# Altium project VNA_BASE_AF2P.PrjPcb
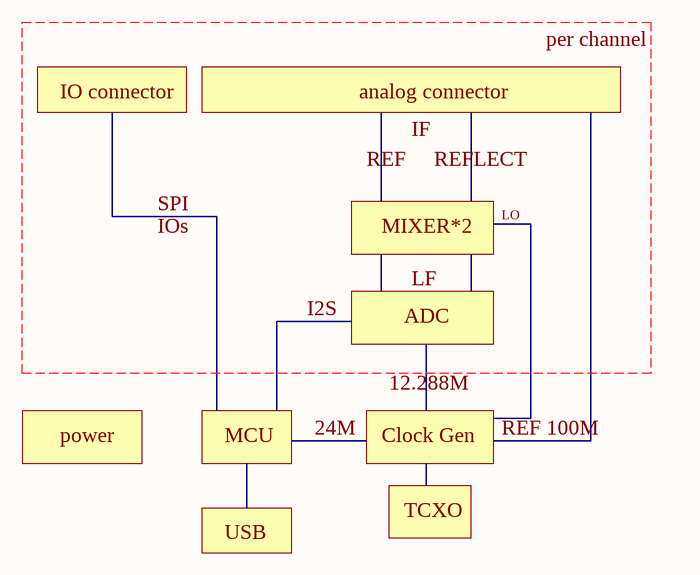
[diagram p0: block_diagram.SchDoc]
10 sheets, 383 parts. Net scope: flat (ports and power ports of the same name join across sheets).
Board file: VNA_BASE_AF2P.PcbDoc
Sheets:
  block_diagram.SchDoc
  downmixersA.SchDoc
  downmixersB.SchDoc
  AudioADCA.SchDoc
  AudioADCB.SchDoc
  clock.SchDoc
  MCU.SchDoc
  connectorA.SchDoc
  connectorB.SchDoc
  power.SchDoc

## Sheet block_diagram.SchDoc
size A4

### Notes on the sheet
- per channel
- IO connector
- analog connector
- REF
- IF
- REFLECT
- SPI
- IOs
- MIXER*2
- I2S
- ADC
- LF
- 12.288M
- power
- MCU
- 24M
- Clock Gen
- REF 100M
- USB
- TCXO

## Sheet downmixersA.SchDoc
size A4
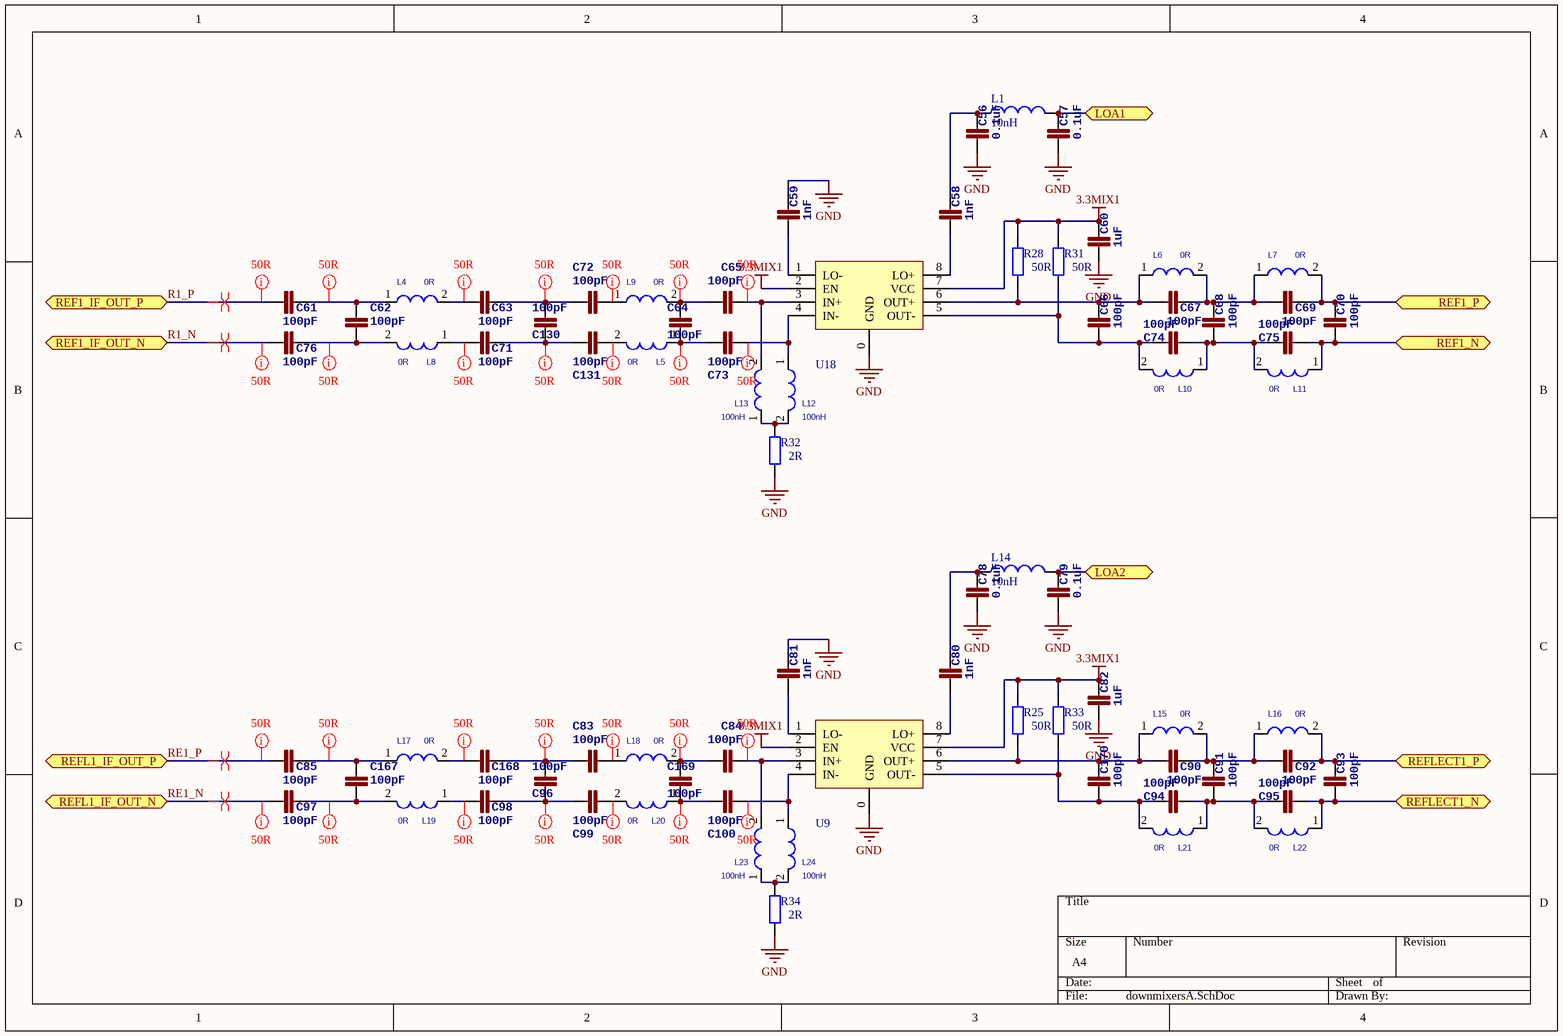
[diagram p1: downmixersA.SchDoc]

### Parts
C56  0.1uF  [0402]
C57  0.1uF  [0402]
C58  1nF  [0402]
C59  1nF  [0402]
C60  1uF  [0402]
C61  100pF  [0402]
C62  100pF  [0402]
C63  100pF  [0402]
C64  100pF  [0402]
C65  100pF  [0402]
C66  100pF  [0402]
C67  100pF  [0402]
C68  100pF  [0402]
C69  100pF  [0402]
C70  100pF  [0402]
C71  100pF  [0402]
C72  100pF  [0402]
C73  100pF  [0402]
C74  100pF  [0402]
C75  100pF  [0402]
C76  100pF  [0402]
C78  0.1uF  [0402]
C79  0.1uF  [0402]
C80  1nF  [0402]
C81  1nF  [0402]
C82  1uF  [0402]
C83  100pF  [0402]
C84  100pF  [0402]
C85  100pF  [0402]
C90  100pF  [0402]
C91  100pF  [0402]
C92  100pF  [0402]
C93  100pF  [0402]
C94  100pF  [0402]
C95  100pF  [0402]
C96  100pF  [0402]
C97  100pF  [0402]
C98  100pF  [0402]
C99  100pF  [0402]
C100  100pF  [0402]
C130  100pF  [0402]
C131  100pF  [0402]
C167  100pF  [0402]
C168  100pF  [0402]
C169  100pF  [0402]
C170  100pF  [0402]
L1  value 10nH  [0402]  (hidden comment: Inductor)
L4  0R  [0805]
L5  0R  [0805]
L6  0R  [0805]
L7  0R  [0805]
L8  0R  [0805]
L9  0R  [0805]
L10  0R  [0805]
L11  0R  [0805]
L12  100nH  [0402]
L13  100nH  [0402]
L14  value 10nH  [0402]  (hidden comment: Inductor)
L15  0R  [0805]
L16  0R  [0805]
L17  0R  [0805]
L18  0R  [0805]
L19  0R  [0805]
L20  0R  [0805]
L21  0R  [0805]
L22  0R  [0805]
L23  100nH  [0402]
L24  100nH  [0402]
R25  50R  [0402]
R28  50R  [0402]
R31  50R  [0402]
R32  2R  [0402]
R33  50R  [0402]
R34  2R  [0402]
U9  LT5560  [LT5560]  (value not drawn)
U18  LT5560  [LT5560]  (value not drawn)

### Ports
LOA1, LOA2, REF1_IF_OUT_N, REF1_IF_OUT_P, REF1_N, REF1_P, REFL1_IF_OUT_N, REFL1_IF_OUT_P, REFLECT1_N, REFLECT1_P

### Nets
3.3MIX1: C60.2 C82.2 R25.2 R28.2 R31.2 R33.2 U9.2(EN) U9.7(VCC) U18.2(EN) U18.7(VCC)
GND: C56.1 C57.1 C59.2 C60.1 C78.1 C79.1 C81.2 C82.1 R32.1 R34.1 U9.0(GND) U18.0(GND)
R1_N: C76.1 ; port REF1_IF_OUT_N
R1_P: C61.1 ; port REF1_IF_OUT_P
RE1_N: C97.1 ; port REFL1_IF_OUT_N
RE1_P: C85.1 ; port REFL1_IF_OUT_P
REF1_N: C70.1 C75.1 L11.1 ; port REF1_N
REF1_P: C69.2 C70.2 L7.2 ; port REF1_P
REFLECT1_N: C93.1 C95.1 L22.1 ; port REFLECT1_N
REFLECT1_P: C92.2 C93.2 L16.2 ; port REFLECT1_P
NetC56_2: C56.2 C58.2 L1.1
NetC57_2: C57.2 L1.2 ; port LOA1
NetC58_1: C58.1 U18.8(LO+)
NetC59_1: C59.1 U18.1(LO-)
NetC61_2: C61.2 C62.2 L4.1
NetC62_1: C62.1 C76.2 L8.2
NetC63_1: C63.1 L4.2
NetC63_2: C63.2 C72.1 C130.1
NetC64_1: C64.1 C73.2 L5.1
NetC64_2: C64.2 C65.1 L9.2
NetC65_2: C65.2 L13.2 U18.3(IN+)
NetC66_1: C66.1 C74.2 L10.2 R31.1 U18.5(OUT-)
NetC66_2: C66.2 C67.1 L6.1 R28.1 U18.6(OUT+)
NetC67_2: C67.2 C68.2 C69.1 L6.2 L7.1
NetC68_1: C68.1 C74.1 C75.2 L10.1 L11.2
NetC71_1: C71.1 L8.1
NetC71_2: C71.2 C130.2 C131.2
NetC72_2: C72.2 L9.1
NetC73_1: C73.1 L12.1 U18.4(IN-)
NetC78_2: C78.2 C80.2 L14.1
NetC79_2: C79.2 L14.2 ; port LOA2
NetC80_1: C80.1 U9.8(LO+)
NetC81_1: C81.1 U9.1(LO-)
NetC83_1: C83.1 C96.1 C168.2
NetC83_2: C83.2 L18.1
NetC84_1: C84.1 C169.2 L18.2
NetC84_2: C84.2 L23.2 U9.3(IN+)
NetC85_2: C85.2 C167.2 L17.1
NetC90_1: C90.1 C170.2 L15.1 R25.1 U9.6(OUT+)
NetC90_2: C90.2 C91.2 C92.1 L15.2 L16.1
NetC91_1: C91.1 C94.1 C95.2 L21.1 L22.2
NetC94_2: C94.2 C170.1 L21.2 R33.1 U9.5(OUT-)
NetC96_2: C96.2 C98.2 C99.2
NetC97_2: C97.2 C167.1 L19.2
NetC98_1: C98.1 L19.1
NetC99_1: C99.1 L20.2
NetC100_1: C100.1 L24.1 U9.4(IN-)
NetC100_2: C100.2 C169.1 L20.1
NetC131_1: C131.1 L5.2
NetC168_1: C168.1 L17.2
NetL12_2: L12.2 L13.1 R32.2
NetL23_1: L23.1 L24.2 R34.2

### Layout directives
net class 50R: NetC61_2, NetC62_1, NetC63_1, NetC63_2, NetC64_1, NetC64_2, NetC65_2, NetC71_1, NetC71_2, NetC72_2, NetC73_1, NetC83_1, NetC83_2, NetC84_1, NetC84_2, NetC85_2, NetC96_2, NetC97_2, NetC98_1, NetC99_1, NetC100_1, NetC100_2, NetC131_1, NetC168_1, R1_N, R1_P, RE1_N, RE1_P
differential pair: R1_N, R1_P, RE1_N, RE1_P

### Library data of the parts
C56-C76 C78-C85 C90-C100 C130 C131 C167-C170 = CAP0402-CAP: <b>Capacitor</b> / Standard 0603 ceramic capacitor, and 0.1" leaded capacitor.; PARTNO: CC0402ZRY5V7BB104
L1 L14 = Inductor: Code_IEC: 1005; Published: 8-Jun-2000; LatestRevisionDate: 29-May-2009; LatestRevisionNote: IPC-7351 Footprint Added.; PackageReference: 0402-A; Publisher: Altium Limited; PackageDescription: Chip Inductor; Code_JEITA: 0402
L4-L13 L15-L24 = L/2.5*2.0
R25 R28 R31-R34 = Res2: Resistor

## Sheet downmixersB.SchDoc
size A4
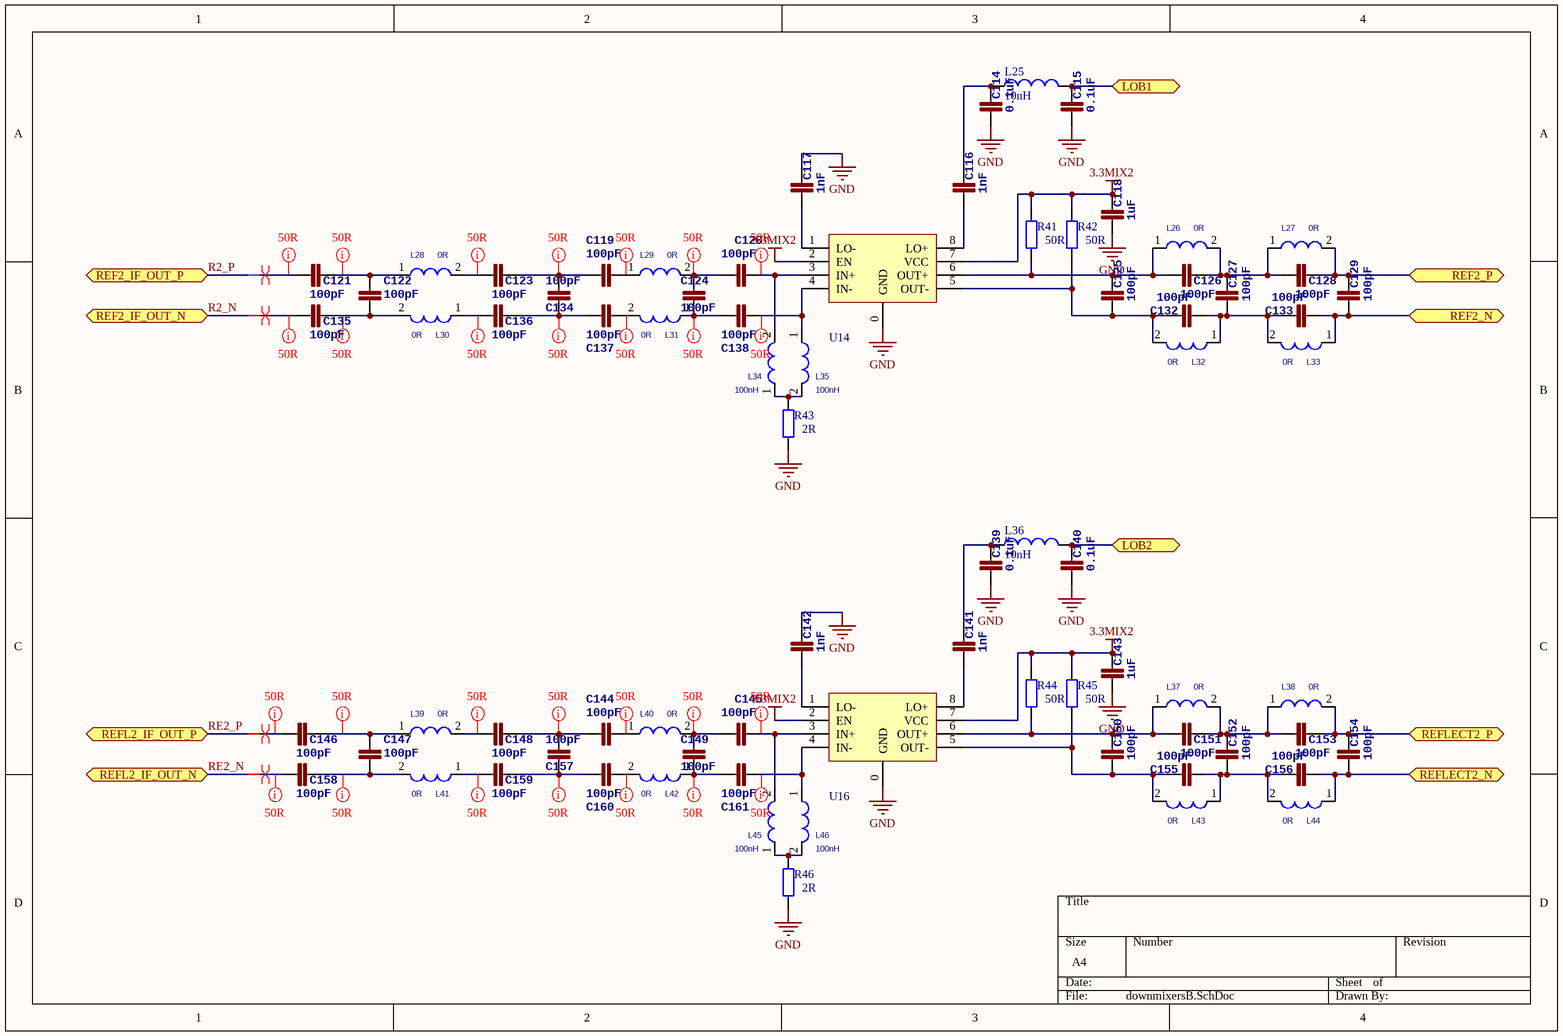
[diagram p2: downmixersB.SchDoc]

### Parts
C114  0.1uF  [0402]
C115  0.1uF  [0402]
C116  1nF  [0402]
C117  1nF  [0402]
C118  1uF  [0402]
C119  100pF  [0402]
C120  100pF  [0402]
C121  100pF  [0402]
C122  100pF  [0402]
C123  100pF  [0402]
C124  100pF  [0402]
C125  100pF  [0402]
C126  100pF  [0402]
C127  100pF  [0402]
C128  100pF  [0402]
C129  100pF  [0402]
C132  100pF  [0402]
C133  100pF  [0402]
C134  100pF  [0402]
C135  100pF  [0402]
C136  100pF  [0402]
C137  100pF  [0402]
C138  100pF  [0402]
C139  0.1uF  [0402]
C140  0.1uF  [0402]
C141  1nF  [0402]
C142  1nF  [0402]
C143  1uF  [0402]
C144  100pF  [0402]
C145  100pF  [0402]
C146  100pF  [0402]
C147  100pF  [0402]
C148  100pF  [0402]
C149  100pF  [0402]
C150  100pF  [0402]
C151  100pF  [0402]
C152  100pF  [0402]
C153  100pF  [0402]
C154  100pF  [0402]
C155  100pF  [0402]
C156  100pF  [0402]
C157  100pF  [0402]
C158  100pF  [0402]
C159  100pF  [0402]
C160  100pF  [0402]
C161  100pF  [0402]
L25  value 10nH  [0402]  (hidden comment: Inductor)
L26  0R  [0805]
L27  0R  [0805]
L28  0R  [0805]
L29  0R  [0805]
L30  0R  [0805]
L31  0R  [0805]
L32  0R  [0805]
L33  0R  [0805]
L34  100nH  [0402]
L35  100nH  [0402]
L36  value 10nH  [0402]  (hidden comment: Inductor)
L37  0R  [0805]
L38  0R  [0805]
L39  0R  [0805]
L40  0R  [0805]
L41  0R  [0805]
L42  0R  [0805]
L43  0R  [0805]
L44  0R  [0805]
L45  100nH  [0402]
L46  100nH  [0402]
R41  50R  [0402]
R42  50R  [0402]
R43  2R  [0402]
R44  50R  [0402]
R45  50R  [0402]
R46  2R  [0402]
U14  LT5560  [LT5560]  (value not drawn)
U16  LT5560  [LT5560]  (value not drawn)

### Ports
LOB1, LOB2, REF2_IF_OUT_N, REF2_IF_OUT_P, REF2_N, REF2_P, REFL2_IF_OUT_N, REFL2_IF_OUT_P, REFLECT2_N, REFLECT2_P

### Nets
3.3MIX2: C118.2 C143.2 R41.2 R42.2 R44.2 R45.2 U14.2(EN) U14.7(VCC) U16.2(EN) U16.7(VCC)
GND: C114.1 C115.1 C117.2 C118.1 C139.1 C140.1 C142.2 C143.1 R43.1 R46.1 U14.0(GND) U16.0(GND)
R2_N: C135.1 ; port REF2_IF_OUT_N
R2_P: C121.1 ; port REF2_IF_OUT_P
RE2_N: C158.1 ; port REFL2_IF_OUT_N
RE2_P: C146.1 ; port REFL2_IF_OUT_P
REF2_N: C129.1 C133.1 L33.1 ; port REF2_N
REF2_P: C128.2 C129.2 L27.2 ; port REF2_P
REFLECT2_N: C154.1 C156.1 L44.1 ; port REFLECT2_N
REFLECT2_P: C153.2 C154.2 L38.2 ; port REFLECT2_P
NetC114_2: C114.2 C116.2 L25.1
NetC115_2: C115.2 L25.2 ; port LOB1
NetC116_1: C116.1 U14.8(LO+)
NetC117_1: C117.1 U14.1(LO-)
NetC119_1: C119.1 C123.2 C134.1
NetC119_2: C119.2 L29.1
NetC120_1: C120.1 C124.2 L29.2
NetC120_2: C120.2 L34.2 U14.3(IN+)
NetC121_2: C121.2 C122.2 L28.1
NetC122_1: C122.1 C135.2 L30.2
NetC123_1: C123.1 L28.2
NetC124_1: C124.1 C138.2 L31.1
NetC125_1: C125.1 C132.2 L32.2 R42.1 U14.5(OUT-)
NetC125_2: C125.2 C126.1 L26.1 R41.1 U14.6(OUT+)
NetC126_2: C126.2 C127.2 C128.1 L26.2 L27.1
NetC127_1: C127.1 C132.1 C133.2 L32.1 L33.2
NetC134_2: C134.2 C136.2 C137.2
NetC136_1: C136.1 L30.1
NetC137_1: C137.1 L31.2
NetC138_1: C138.1 L35.1 U14.4(IN-)
NetC139_2: C139.2 C141.2 L36.1
NetC140_2: C140.2 L36.2 ; port LOB2
NetC141_1: C141.1 U16.8(LO+)
NetC142_1: C142.1 U16.1(LO-)
NetC144_1: C144.1 C148.2 C157.1
NetC144_2: C144.2 L40.1
NetC145_1: C145.1 C149.2 L40.2
NetC145_2: C145.2 L45.2 U16.3(IN+)
NetC146_2: C146.2 C147.2 L39.1
NetC147_1: C147.1 C158.2 L41.2
NetC148_1: C148.1 L39.2
NetC149_1: C149.1 C161.2 L42.1
NetC150_1: C150.1 C155.2 L43.2 R45.1 U16.5(OUT-)
NetC150_2: C150.2 C151.1 L37.1 R44.1 U16.6(OUT+)
NetC151_2: C151.2 C152.2 C153.1 L37.2 L38.1
NetC152_1: C152.1 C155.1 C156.2 L43.1 L44.2
NetC157_2: C157.2 C159.2 C160.2
NetC159_1: C159.1 L41.1
NetC160_1: C160.1 L42.2
NetC161_1: C161.1 L46.1 U16.4(IN-)
NetL34_1: L34.1 L35.2 R43.2
NetL45_1: L45.1 L46.2 R46.2

### Layout directives
net class 50R: NetC119_1, NetC119_2, NetC120_1, NetC120_2, NetC121_2, NetC122_1, NetC123_1, NetC124_1, NetC134_2, NetC136_1, NetC137_1, NetC138_1, NetC144_1, NetC144_2, NetC145_1, NetC145_2, NetC146_2, NetC147_1, NetC148_1, NetC149_1, NetC157_2, NetC159_1, NetC160_1, NetC161_1, R2_N, R2_P, RE2_N, RE2_P
differential pair: R2_N, R2_P, RE2_N, RE2_P

### Library data of the parts
C114-C129 C132-C161 = CAP0402-CAP: as C56 on sheet downmixersA
L25 L36 = Inductor: Code_IEC: 1005; Published: 8-Jun-2000; LatestRevisionDate: 29-May-2009; LatestRevisionNote: IPC-7351 Footprint Added.; PackageReference: 0402-A; Publisher: Altium Limited; PackageDescription: Chip Inductor; Code_JEITA: 0402
L26-L35 L37-L46 = L/2.5*2.0
R41-R46 = Res2: Resistor

## Sheet AudioADCA.SchDoc
size A4
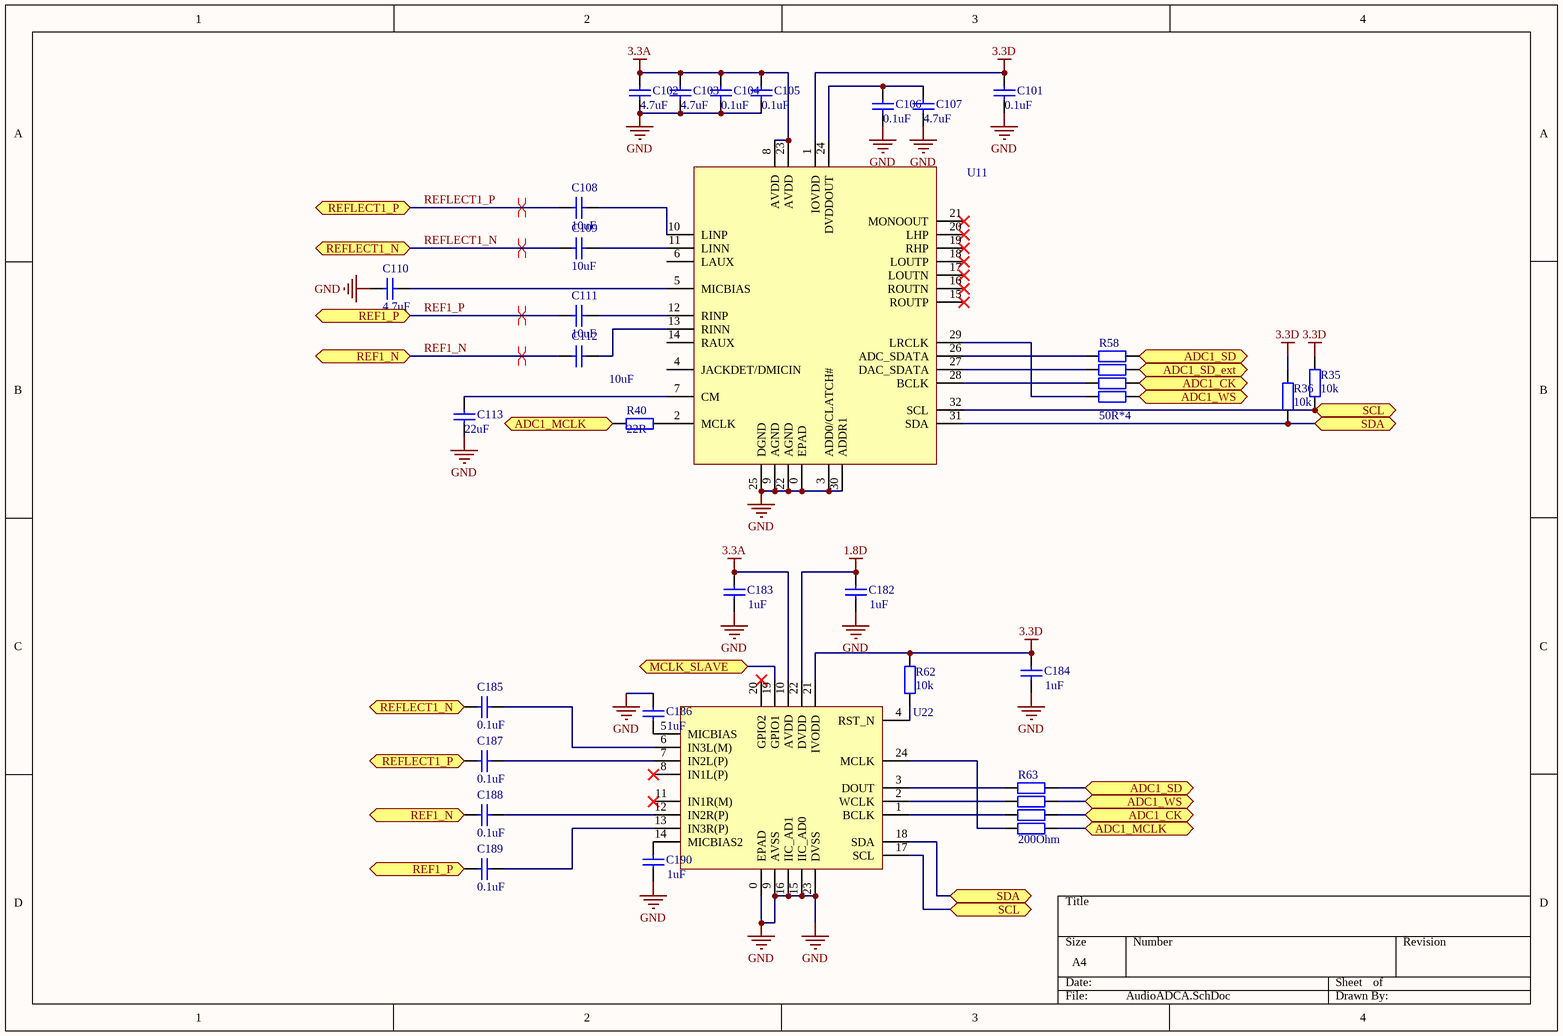
[diagram p3: AudioADCA.SchDoc]

### Parts
C101  0.1uF  [0402]
C102  4.7uF  [0805]
C103  4.7uF  [0805]
C104  0.1uF  [0402]
C105  0.1uF  [0402]
C106  0.1uF  [0402]
C107  4.7uF  [0805]
C108  10uF  [0402]
C109  10uF  [0402]
C110  4.7uF  [0402]
C111  10uF  [0402]
C112  10uF  [0402]
C113  22uF  [0805]
C182  1uF  [0402]
C183  1uF  [0402]
C184  1uF  [0402]
C185  0.1uF  [0402]
C186  1uF  [0402]
C187  0.1uF  [0402]
C188  0.1uF  [0402]
C189  0.1uF  [0402]
C190  1uF  [0402]
R35  value 10k  [0402]  (hidden comment: Res2)
R36  value 10k  [0402]  (hidden comment: Res2)
R40  22R  [0402]
R58  50R*4  [0402X4]
R62  value 10k  [0402]  (hidden comment: Res2)
R63  value 200Ohm  [0402X4]  (hidden comment: Res*4)
U11  ADAU1761  [ADAU1761]  (value not drawn)
U22  TLV320ADC3101  [TLV320ADC3101]  (value not drawn)

### Ports
ADC1_CK, ADC1_MCLK, ADC1_SD, ADC1_SD_ext, ADC1_WS, MCLK_SLAVE, REF1_N, REF1_P, REFLECT1_N, REFLECT1_P, SCL, SDA

### Nets
1.8D: C182.2 U22.22(DVDD)
3.3A: C102.2 C103.2 C104.2 C105.2 C183.2 U11.8(AVDD) U11.23(AVDD) U22.10(AVDD)
3.3D: C101.2 C184.2 R35.2 R36.2 R62.2 U11.1(IOVDD) U22.21(IVODD)
GND: C101.1 C102.1 C103.1 C104.1 C105.1 C106.1 C107.1 C110.1 C113.1 C182.1 C183.1 C184.1 C186.2 C190.1 U11.0(EPAD) U11.3(ADD0/CLATCH#) U11.9(AGND) U11.22(AGND) U11.25(DGND) U11.30(ADDR1) U22.0(EPAD) U22.9(AVSS) U22.15(IIC_AD0) U22.16(IIC_AD1) U22.23(DVSS)
REF1_N: C112.1 C188.2 ; port REF1_N
REF1_P: C111.1 C189.2 ; port REF1_P
REFLECT1_N: C109.2 C185.2 ; port REFLECT1_N
REFLECT1_P: C108.2 C187.2 ; port REFLECT1_P
NetC106_2: C106.2 C107.2 U11.24(DVDDOUT)
NetC108_1: C108.1 U11.10(LINP)
NetC109_1: C109.1 U11.11(LINN)
NetC110_2: C110.2 U11.5(MICBIAS)
NetC111_2: C111.2 U11.12(RINP)
NetC112_2: C112.2 U11.13(RINN)
NetC113_2: C113.2 U11.7(CM)
NetC185_1: C185.1 U22.6(IN3L(M))
NetC186_1: C186.1 U22.5(MICBIAS)
NetC187_1: C187.1 U22.7(IN2L(P))
NetC188_1: C188.1 U22.12(IN2R(P))
NetC189_1: C189.1 U22.13(IN3R(P))
NetC190_2: C190.2 U22.14(MICBIAS2)
NetR11_2: R36.1 U11.31(SDA) U22.18(SDA) ; port SDA
NetR12_2: R35.1 U11.32(SCL) U22.17(SCL) ; port SCL
NetR40_1: R40.1 U11.2(MCLK)
NetR40_2: R40.2 R63.5 ; port ADC1_MCLK
NetR53_1: R58.3 R63.6 ; port ADC1_CK
NetR53_2: R58.4 R63.7 ; port ADC1_WS
NetR53_3: R58.2 ; port ADC1_SD_ext
NetR53_4: R58.1 R63.8 ; port ADC1_SD
NetR58_5: R58.5 U11.29(LRCLK)
NetR58_6: R58.6 U11.28(BCLK)
NetR58_7: R58.7 U11.27(DAC_SDATA)
NetR58_8: R58.8 U11.26(ADC_SDATA)
NetR60_5: U22.19(GPIO1) ; port MCLK_SLAVE
NetR62_1: R62.1 U22.4(RST_N)
NetR63_1: R63.1 U22.3(DOUT)
NetR63_2: R63.2 U22.2(WCLK)
NetR63_3: R63.3 U22.1(BCLK)
NetR63_4: R63.4 U22.24(MCLK)

Not connected (* = marked no-connect by the designer): U11 4(JACKDET/DMICIN) 6(LAUX) 14(RAUX) 15(ROUTP)* 16(ROUTN)* 17(LOUTN)* 18(LOUTP)* 19(RHP)* 20(LHP)* 21(MONOOUT)*; U22 8(IN1L(P))* 11(IN1R(M))* 20(GPIO2)*

### Layout directives
differential pair: REF1_N, REF1_P, REFLECT1_N, REFLECT1_P

### Library data of the parts
C101-C113 C182-C190 = Cap: Capacitor
  C101-C113 C185 C187-C189: Published: 8-Jun-2000; LatestRevisionDate: 17-Jul-2002; LatestRevisionNote: Re-released for DXP Platform.; PackageReference: RAD-0.3; Publisher: Altium Limited; PackageDescription: Radial Cap, Thru-Hole; 2 Leads; 0.3 in Pin Spacing
R35 R36 R40 R62 = Res2: Resistor; Published: 8-Jun-2000; LatestRevisionDate: 17-Jul-2002; LatestRevisionNote: Re-released for DXP Platform.; PackageReference: AXIAL-0.4; Publisher: Altium Limited; PackageDescription: Axial Device, Thru-Hole; 2 Leads; 0.4 in Pin Spacing
R58 R63 = Res*4: Resistor; Published: 8-Jun-2000; LatestRevisionDate: 17-Jul-2002; LatestRevisionNote: Re-released for DXP Platform.; PackageReference: AXIAL-0.4; Publisher: Altium Limited; PackageDescription: Axial Device, Thru-Hole; 2 Leads; 0.4 in Pin Spacing

## Sheet AudioADCB.SchDoc
size A4
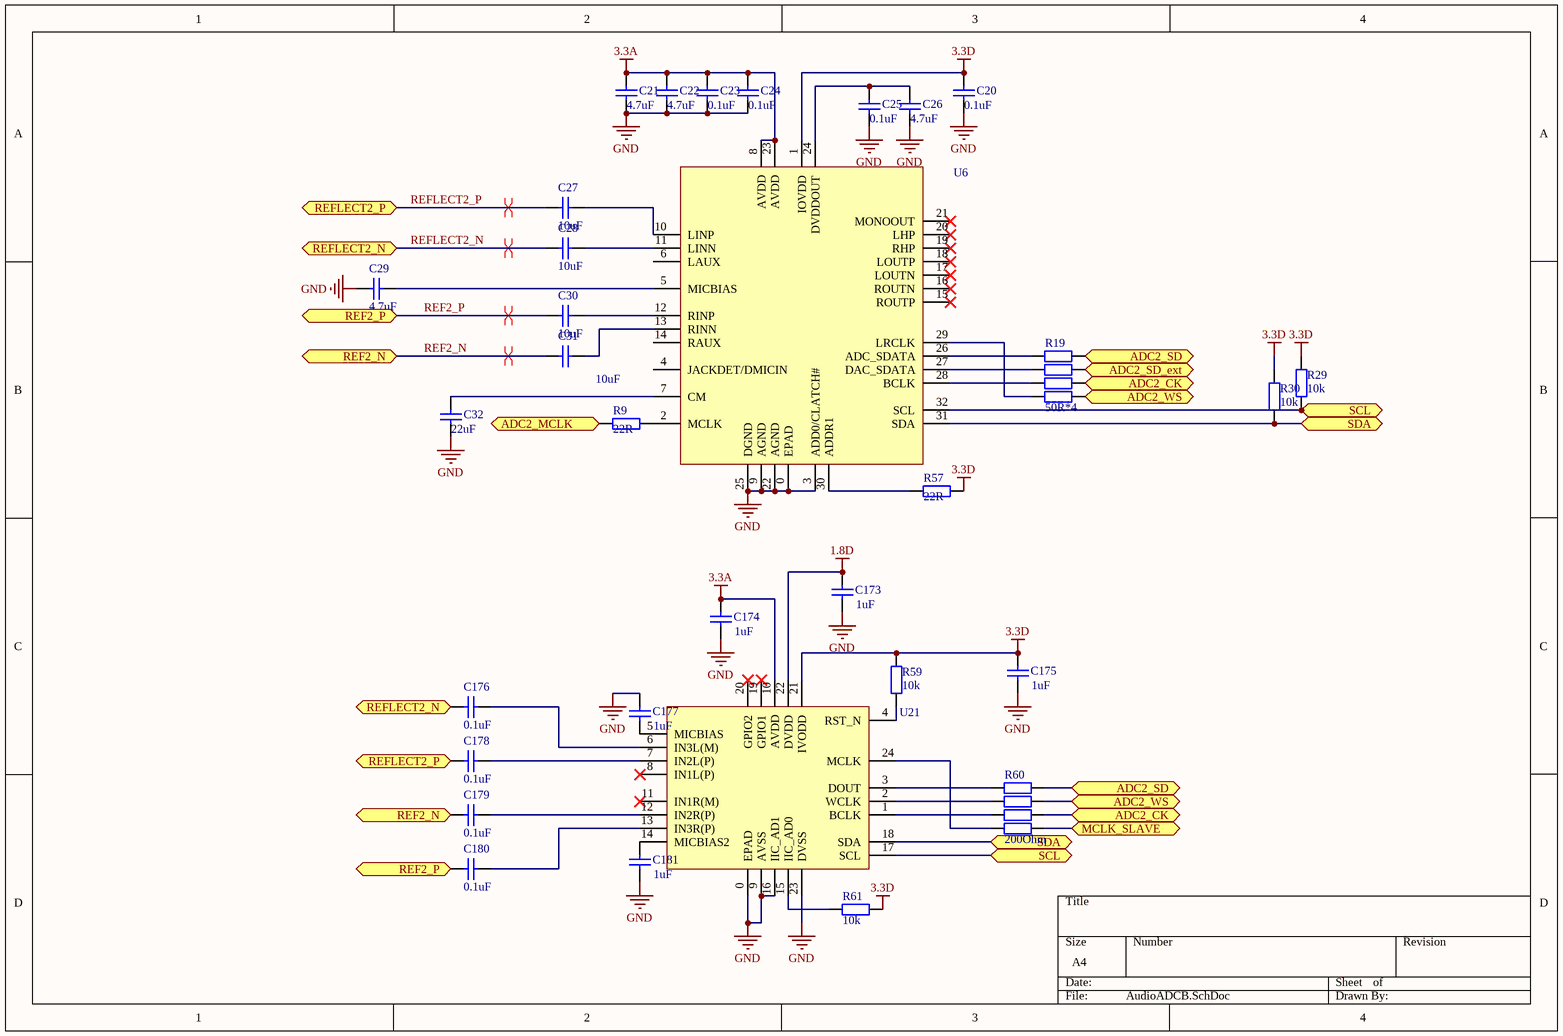
[diagram p4: AudioADCB.SchDoc]

### Parts
C20  0.1uF  [0402]
C21  4.7uF  [0805]
C22  4.7uF  [0805]
C23  0.1uF  [0402]
C24  0.1uF  [0402]
C25  0.1uF  [0402]
C26  4.7uF  [0805]
C27  10uF  [0402]
C28  10uF  [0402]
C29  4.7uF  [0402]
C30  10uF  [0402]
C31  10uF  [0402]
C32  22uF  [0805]
C173  1uF  [0402]
C174  1uF  [0402]
C175  1uF  [0402]
C176  0.1uF  [0402]
C177  1uF  [0402]
C178  0.1uF  [0402]
C179  0.1uF  [0402]
C180  0.1uF  [0402]
C181  1uF  [0402]
R9  22R  [0402]
R19  50R*4  [0402X4]
R29  value 10k  [0402]  (hidden comment: Res2)
R30  value 10k  [0402]  (hidden comment: Res2)
R57  22R  [0402]
R59  value 10k  [0402]  (hidden comment: Res2)
R60  value 200Ohm  [0402X4]  (hidden comment: Res*4)
R61  value 10k  [0402]  (hidden comment: Res2)
U6  ADAU1761  [ADAU1761]  (value not drawn)
U21  TLV320ADC3101  [TLV320ADC3101]  (value not drawn)

### Ports
ADC2_CK, ADC2_MCLK, ADC2_SD, ADC2_SD_ext, ADC2_WS, MCLK_SLAVE, REF2_N, REF2_P, REFLECT2_N, REFLECT2_P, SCL, SDA

### Nets
1.8D: C173.2 U21.22(DVDD)
3.3A: C21.2 C22.2 C23.2 C24.2 C174.2 U6.8(AVDD) U6.23(AVDD) U21.10(AVDD)
3.3D: C20.2 C175.2 R29.2 R30.2 R57.1 R59.2 R61.1 U6.1(IOVDD) U21.21(IVODD)
GND: C20.1 C21.1 C22.1 C23.1 C24.1 C25.1 C26.1 C29.1 C32.1 C173.1 C174.1 C175.1 C177.2 C181.1 U6.0(EPAD) U6.3(ADD0/CLATCH#) U6.9(AGND) U6.22(AGND) U6.25(DGND) U21.0(EPAD) U21.9(AVSS) U21.16(IIC_AD1) U21.23(DVSS)
PA15: R19.4 R60.7 ; port ADC2_WS
REF2_N: C31.1 C179.2 ; port REF2_N
REF2_P: C30.1 C180.2 ; port REF2_P
REFLECT2_N: C28.2 C176.2 ; port REFLECT2_N
REFLECT2_P: C27.2 C178.2 ; port REFLECT2_P
NetC25_2: C25.2 C26.2 U6.24(DVDDOUT)
NetC27_1: C27.1 U6.10(LINP)
NetC28_1: C28.1 U6.11(LINN)
NetC29_2: C29.2 U6.5(MICBIAS)
NetC30_2: C30.2 U6.12(RINP)
NetC31_2: C31.2 U6.13(RINN)
NetC32_2: C32.2 U6.7(CM)
NetC176_1: C176.1 U21.6(IN3L(M))
NetC177_1: C177.1 U21.5(MICBIAS)
NetC178_1: C178.1 U21.7(IN2L(P))
NetC179_1: C179.1 U21.12(IN2R(P))
NetC180_1: C180.1 U21.13(IN3R(P))
NetC181_2: C181.2 U21.14(MICBIAS2)
NetR8_2: R9.2 ; port ADC2_MCLK
NetR9_1: R9.1 U6.2(MCLK)
NetR11_2: R30.1 U6.31(SDA) U21.18(SDA) ; port SDA
NetR12_2: R29.1 U6.32(SCL) U21.17(SCL) ; port SCL
NetR19_1: R19.1 R60.8 ; port ADC2_SD
NetR19_2: R19.2 ; port ADC2_SD_ext
NetR19_3: R19.3 R60.6 ; port ADC2_CK
NetR19_5: R19.5 U6.29(LRCLK)
NetR19_6: R19.6 U6.28(BCLK)
NetR19_7: R19.7 U6.27(DAC_SDATA)
NetR19_8: R19.8 U6.26(ADC_SDATA)
NetR57_2: R57.2 U6.30(ADDR1)
NetR59_1: R59.1 U21.4(RST_N)
NetR60_1: R60.1 U21.3(DOUT)
NetR60_2: R60.2 U21.2(WCLK)
NetR60_3: R60.3 U21.1(BCLK)
NetR60_4: R60.4 U21.24(MCLK)
NetR60_5: R60.5 ; port MCLK_SLAVE
NetR61_2: R61.2 U21.15(IIC_AD0)

Not connected (* = marked no-connect by the designer): U6 4(JACKDET/DMICIN) 6(LAUX) 14(RAUX) 15(ROUTP)* 16(ROUTN)* 17(LOUTN)* 18(LOUTP)* 19(RHP)* 20(LHP)* 21(MONOOUT)*; U21 8(IN1L(P))* 11(IN1R(M))* 19(GPIO1)* 20(GPIO2)*

### Layout directives
differential pair: REF2_N, REF2_P, REFLECT2_N, REFLECT2_P

### Library data of the parts
C20-C32 C173-C181 = Cap: Capacitor
  C20-C32 C176 C178-C180: Published: 8-Jun-2000; LatestRevisionDate: 17-Jul-2002; LatestRevisionNote: Re-released for DXP Platform.; PackageReference: RAD-0.3; Publisher: Altium Limited; PackageDescription: Radial Cap, Thru-Hole; 2 Leads; 0.3 in Pin Spacing
R9 R29 R30 R57 R59 R61 = Res2: Resistor; Published: 8-Jun-2000; LatestRevisionDate: 17-Jul-2002; LatestRevisionNote: Re-released for DXP Platform.; PackageReference: AXIAL-0.4; Publisher: Altium Limited; PackageDescription: Axial Device, Thru-Hole; 2 Leads; 0.4 in Pin Spacing
R19 R60 = Res*4: Resistor; Published: 8-Jun-2000; LatestRevisionDate: 17-Jul-2002; LatestRevisionNote: Re-released for DXP Platform.; PackageReference: AXIAL-0.4; Publisher: Altium Limited; PackageDescription: Axial Device, Thru-Hole; 2 Leads; 0.4 in Pin Spacing

## Sheet clock.SchDoc
size A4
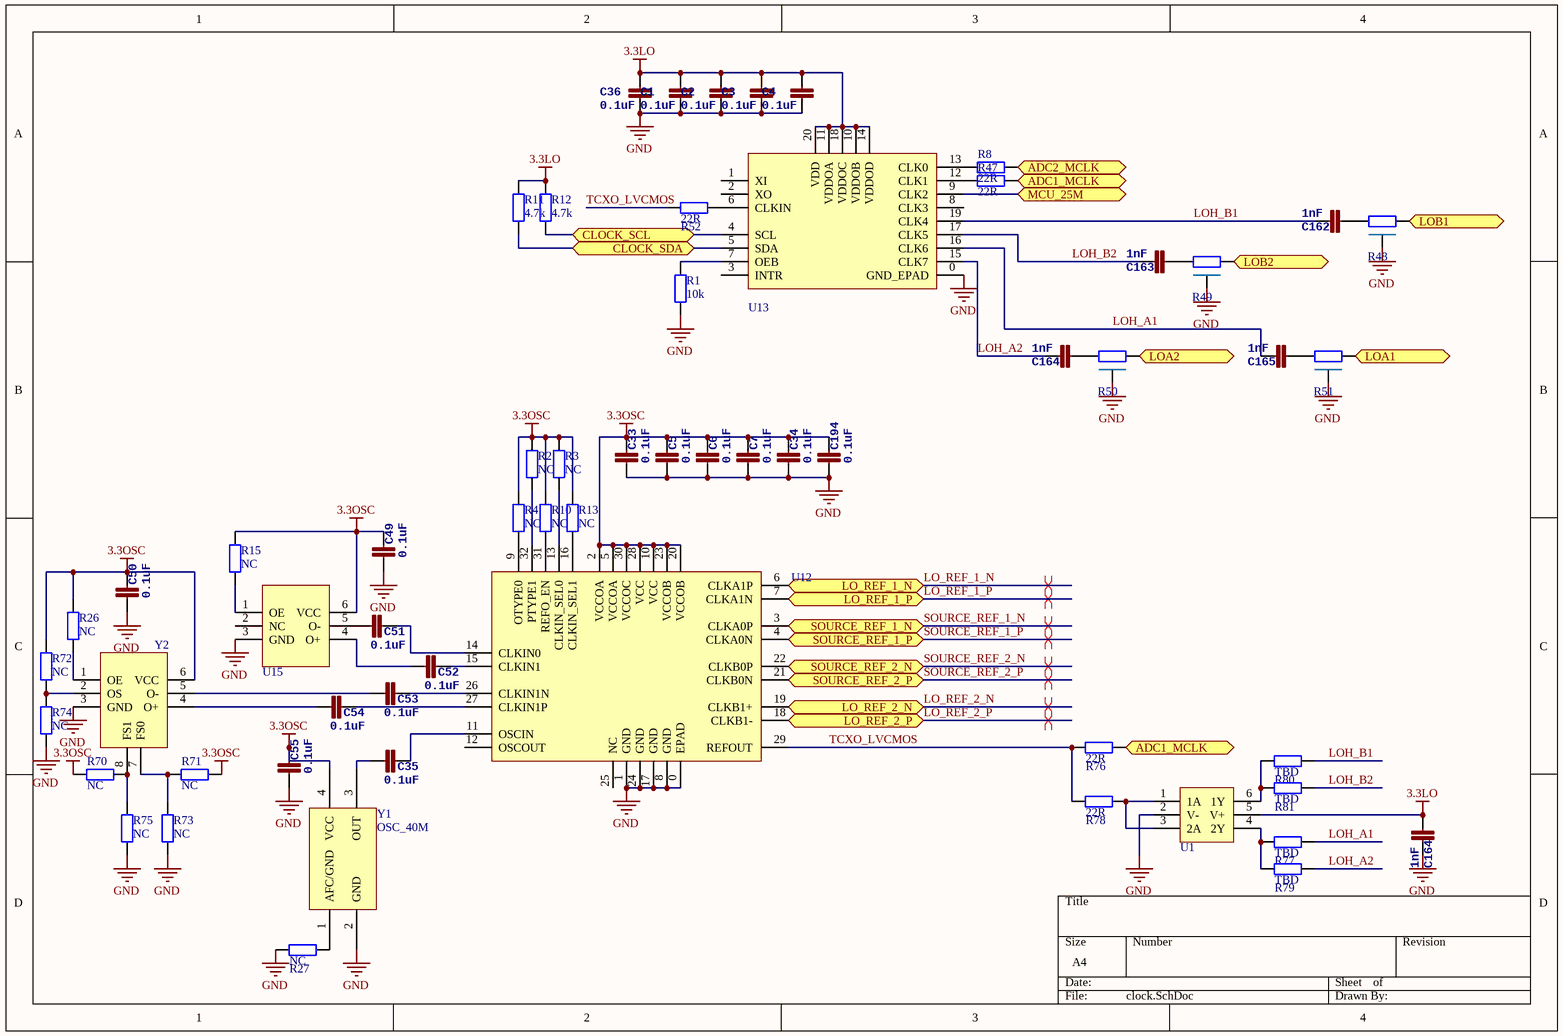
[diagram p5: clock.SchDoc]

### Parts
(Parts that share a designator on the sheet are numbered #1, #2 ... from top to bottom, then left to right.)
C1  0.1uF  [0402]
C2  0.1uF  [0402]
C3  0.1uF  [0402]
C4  0.1uF  [0402]
C5  0.1uF  [0402]
C6  0.1uF  [0402]
C7  0.1uF  [0402]
C33  0.1uF  [0402]
C34  0.1uF  [0402]
C35  0.1uF  [0402]
C36  0.1uF  [0402]
C49  0.1uF  [0402]
C50  0.1uF  [0402]
C51  0.1uF  [0402]
C52  0.1uF  [0402]
C53  0.1uF  [0402]
C54  0.1uF  [0402]
C55  0.1uF  [0402]
C162  1nF  [0402]
C163  1nF  [0402]
C164#1  1nF  [0402]
C164#2  1nF  [0402]
C165  1nF  [0402]
C194  0.1uF  [0402]
R1  10k  [0402]
R2  NC  [0402]
R3  NC  [0402]
R4  NC  [0402]
R8  22R  [0402]
R10  NC  [0402]
R11  4.7k  [0402]
R12  4.7k  [0402]
R13  NC  [0402]
R15  NC  [0402]
R26  NC  [0402]
R27  NC  [0402]
R47  22R  [0402]
R48  PiFilter  [PiFIiter]  (value not drawn)
R49  PiFilter  [PiFIiter]  (value not drawn)
R50  PiFilter  [PiFIiter]  (value not drawn)
R51  PiFilter  [PiFIiter]  (value not drawn)
R52  22R  [0402]
R70  NC  [0402]
R71  NC  [0402]
R72  NC  [0402]
R73  NC  [0402]
R74  NC  [0402]
R75  NC  [0402]
R76  22R  [0402]
R77  TBD  [0402]
R78  22R  [0402]
R79  TBD  [0402]
R80  TBD  [0402]
R81  TBD  [0402]
U1  74-2G04/14  [SOT23-6]  (value not drawn)
U12  LM00304-FUNC  [LMK00304]  (value not drawn)
U13  SI5351C  [si5351c]  (value not drawn)
U15  OSC_DIFF  [OSC3225_DIFF]  (value not drawn)
Y1  OSC_40M  [TXC_7Q]
Y2  OSC_DIFF_TI  [OSC7050-LMK61PD0A2]  (value not drawn)

### Ports
ADC1_MCLK, ADC2_MCLK, CLOCK_SCL, CLOCK_SDA, LO_REF_1_N, LO_REF_1_P, LO_REF_2_N, LO_REF_2_P, LOA1, LOA2, LOB1, LOB2, MCU_25M, SOURCE_REF_1_N, SOURCE_REF_1_P, SOURCE_REF_2_N, SOURCE_REF_2_P

### Nets
3.3LO: C1.2 C2.2 C3.2 C4.2 C36.2 C164#2.2 R11.1 R12.1 U1.5(V+) U13.10(VDDOB) U13.11(VDDOA) U13.14(VDDOD) U13.18(VDDOC) U13.20(VDD)
3.3OSC: C5.2 C6.2 C7.2 C33.2 C34.2 C49.2 C50.2 C55.2 C194.2 R2.1 R3.1 R4.1 R10.1 R13.1 R15.1 R26.1 R70.1 R71.2 R72.2 U12.2(VCCOA) U12.5(VCCOA) U12.10(VCC) U12.20(VCCOB) U12.23(VCCOB) U12.28(VCC) U12.30(VCCOC) U15.6(VCC) Y1.4(VCC) Y2.6(VCC)
GND: C1.1 C2.1 C3.1 C4.1 C5.1 C6.1 C7.1 C33.1 C34.1 C36.1 C49.1 C50.1 C55.1 C164#2.1 C194.1 R1.1 R27.2 R48.3 R49.3 R50.3 R51.3 R73.1 R74.1 R75.1 U1.2(V-) U12.0(EPAD) U12.1(GND) U12.8(GND) U12.17(GND) U12.24(GND) U13.0(GND_EPAD) U15.3(GND) Y1.2(GND) Y2.3(GND)
LO_REF_1_N: U12.6(CLKA1P) ; port LO_REF_1_N
LO_REF_1_P: U12.7(CLKA1N) ; port LO_REF_1_P
LO_REF_2_N: U12.19(CLKB1+) ; port LO_REF_2_N
LO_REF_2_P: U12.18(CLKB1-) ; port LO_REF_2_P
LOH_A1: C165.1 R77.1 U13.16(CLK6)
LOH_A2: C164#1.1 R79.1 U13.15(CLK7)
LOH_B1: C162.1 R80.1 U13.19(CLK4)
LOH_B2: C163.1 R81.1 U13.17(CLK5)
SOURCE_REF_1_N: U12.3(CLKA0P) ; port SOURCE_REF_1_N
SOURCE_REF_1_P: U12.4(CLKA0N) ; port SOURCE_REF_1_P
SOURCE_REF_2_N: U12.22(CLKB0P) ; port SOURCE_REF_2_N
SOURCE_REF_2_P: U12.21(CLKB0N) ; port SOURCE_REF_2_P
TCXO_LVCMOS: R52.2 R76.2 R78.2 U12.29(REFOUT)
NetC35_1: C35.1 Y1.3(OUT)
NetC35_2: C35.2 U12.11(OSCIN)
NetC37_2: U13.9(CLK2) ; port MCU_25M
NetC51_1: C51.1 U15.5(O-)
NetC51_2: C51.2 U12.14(CLKIN0)
NetC52_1: C52.1 U15.4(O+)
NetC52_2: C52.2 U12.15(CLKIN1)
NetC53_1: C53.1 Y2.5(O-)
NetC53_2: C53.2 U12.26(CLKIN1N)
NetC54_1: C54.1 Y2.4(O+)
NetC54_2: C54.2 U12.27(CLKIN1P)
NetC57_2: R51.1 ; port LOA1
NetC79_2: R50.1 ; port LOA2
NetC115_2: R48.2 ; port LOB1
NetC140_2: R49.2 ; port LOB2
NetC162_2: C162.2 R48.1
NetC163_2: C163.2 R49.1
NetC164#1_2: C164#1.2 R50.2
NetC165_2: C165.2 R51.2
NetR1_2: R1.2 U13.7(OEB)
NetR2_2: R2.2 U12.32(PTYPE1)
NetR3_2: R3.2 U12.13(CLKIN_SEL0)
NetR4_2: R4.2 U12.9(OTYPE0)
NetR8_1: R8.1 U13.13(CLK0)
NetR8_2: R8.2 ; port ADC2_MCLK
NetR10_2: R10.2 U12.31(REFO_EN)
NetR11_2: R11.2 U13.5(SDA) ; port CLOCK_SDA
NetR12_2: R12.2 U13.4(SCL) ; port CLOCK_SCL
NetR13_2: R13.2 U12.16(CLKIN_SEL1)
NetR15_2: R15.2 U15.1(OE)
NetR26_2: R26.2 Y2.1(OE)
NetR27_1: R27.1 Y1.1(AFC/GND)
NetR40_2: R47.2 R76.1 ; port ADC1_MCLK
NetR47_1: R47.1 U13.12(CLK1)
NetR52_1: R52.1 U13.6(CLKIN)
NetR70_2: R70.2 R75.2 Y2.8(FS1)
NetR71_1: R71.1 R73.2 Y2.7(FS0)
NetR72_1: R72.1 R74.2 Y2.2(OS)
NetR77_2: R77.2 R79.2 U1.4(2Y)
NetR78_1: R78.1 U1.1(1A) U1.3(2A)
NetR80_2: R80.2 R81.2 U1.6(1Y)

Not connected (* = marked no-connect by the designer): U12 12(OSCOUT) 25(NC); U13 1(XI) 2(XO) 3(INTR) 8(CLK3); U15 2(NC)

### Layout directives
differential pair: LO_REF_1_N, LO_REF_1_P, LO_REF_2_N, LO_REF_2_P, SOURCE_REF_1_N, SOURCE_REF_1_P, SOURCE_REF_2_N, SOURCE_REF_2_P

### Library data of the parts
C1-C7 C33-C36 C49-C55 C162 C163 C164#1 C164#2 C165 C194 = CAP0402-CAP: as C56 on sheet downmixersA
R1-R4 R8 R10-R13 R15 R26 R27 R47 R52 R70-R81 = Res2: Resistor
  R1 R8 R11 R12 R47 R52 R76-R81: Published: 8-Jun-2000; LatestRevisionDate: 17-Jul-2002; LatestRevisionNote: Re-released for DXP Platform.; PackageReference: AXIAL-0.4; Publisher: Altium Limited; PackageDescription: Axial Device, Thru-Hole; 2 Leads; 0.4 in Pin Spacing

## Sheet MCU.SchDoc
size A4
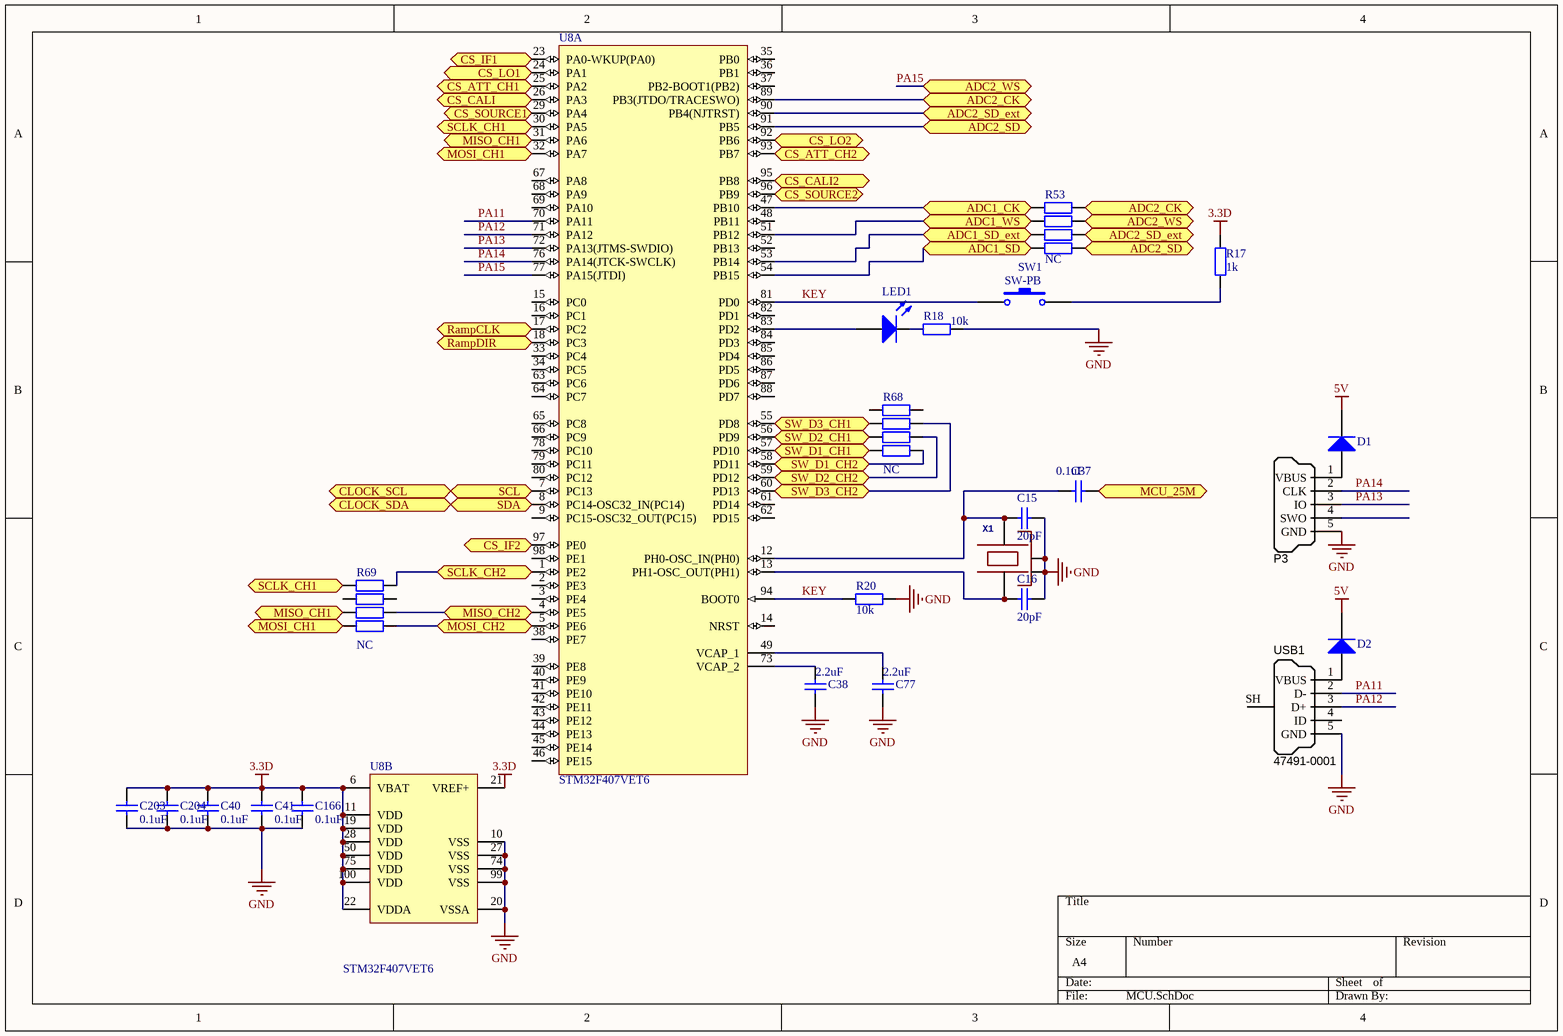
[diagram p6: MCU.SchDoc]

### Parts
C15  value 20pF  [0402]  (hidden comment: Cap)
C16  value 20pF  [0402]  (hidden comment: Cap)
C37  0.1uF  [0402]
C38  2.2uF  [0603]
C40  value 0.1uF  [0402]  (hidden comment: Cap)
C41  value 0.1uF  [0402]  (hidden comment: Cap)
C77  2.2uF  [0603]
C166  value 0.1uF  [0402]  (hidden comment: Cap)
C203  value 0.1uF  [0402]  (hidden comment: Cap)
C204  value 0.1uF  [0402]  (hidden comment: Cap)
D1  (no value)  [LC-SOD-323]
D2  (no value)  [LC-SOD-323]
LED1  LED0  [0603]  (value not drawn)
P3  SWD_MicroUSB  [MICRO-YZX]  (value not drawn)
R17  1k  [0402]
R18  10k  [0402]
R20  value 10k  [0402]  (hidden comment: Res2)
R53  NC  [0402X4]
R68  NC  [0402X4]
R69  NC  [0402X4]
SW1  SW-PB  [SW3x4]
U8  STM32F407VET6  [STM-LQFP100_N]  (parts A,B of 2)
USB1  Manufacturer Part Number 1: 47491-0001  [MICRO-YZX]  (hidden comment: USB Micro Type B)
X1  24.000 KHz 3.2x2.5mm 8-10pf  [OSCILLATOR-2.5x2.0]  (value not drawn)

### Ports
ADC1_CK, ADC1_SD, ADC1_SD_ext, ADC1_WS, ADC2_CK, ADC2_SD, ADC2_SD_ext, ADC2_WS, CLOCK_SCL, CLOCK_SDA, CS_ATT_CH1, CS_ATT_CH2, CS_CALI, CS_CALI2, CS_IF1, CS_IF2, CS_LO1, CS_LO2, CS_SOURCE1, CS_SOURCE2, MCU_25M, MISO_CH1, MISO_CH2, MOSI_CH1, MOSI_CH2, RampCLK, RampDIR, SCL, SCLK_CH1, SCLK_CH2, SDA, SW_D1_CH1, SW_D1_CH2, SW_D2_CH1, SW_D2_CH2, SW_D3_CH1, SW_D3_CH2

### Nets
3.3D: C40.2 C41.2 C166.2 C203.2 C204.2 R17.2 U8.6(VBAT) U8.11(VDD) U8.19(VDD) U8.21(VREF+) U8.22(VDDA) U8.28(VDD) U8.50(VDD) U8.75(VDD) U8.100(VDD)
5V: D1.2(K) D2.2(K)
GND: C15.1 C16.1 C38.1 C40.1 C41.1 C77.1 C166.1 C203.1 C204.1 P3.5(GND) R18.2 R20.2 U8.10(VSS) U8.20(VSSA) U8.27(VSS) U8.74(VSS) U8.99(VSS) USB1.5(GND) X1.2(NC_2) X1.4(NC_4)
CS_LO: U8.24(PA1) ; port CS_LO1
CS_LO2: U8.92(PB6) ; port CS_LO2
CS_SOURCE: U8.29(PA4) ; port CS_SOURCE1
CS_SOURCE2: U8.96(PB9) ; port CS_SOURCE2
CSB_ATT: U8.25(PA2) ; port CS_ATT_CH1
CSB_ATT2: U8.93(PB7) ; port CS_ATT_CH2
IF_CS: U8.23(PA0-WKUP(PA0)) ; port CS_IF1
IF_CS2: U8.97(PE0) ; port CS_IF2
IF_MOSI: R69.5 U8.32(PA7) ; port MOSI_CH1
IF_MOSI2: R69.4 U8.5(PE6) ; port MOSI_CH2
IF_SCLK: R69.8 U8.30(PA5) ; port SCLK_CH1
IF_SCLK2: R69.1 U8.1(PE2) ; port SCLK_CH2
KEY: R20.1 SW1.1 U8.81(PD0) U8.94(BOOT0)
PA11: U8.70(PA11) USB1.2(D-)
PA12: U8.71(PA12) USB1.3(D+)
PA13: P3.3(IO) U8.72(PA13(JTMS-SWDIO))
PA14: P3.2(CLK) U8.76(PA14(JTCK-SWCLK))
PA15: R53.7 U8.77(PA15(JTDI)) ; port ADC2_WS
RampCLK_LO: U8.17(PC2) ; port RampCLK
RampDIR_LO: U8.18(PC3) ; port RampDIR
SW1D1: R68.5 U8.57(PD10) ; port SW_D1_CH1
SW1D2: R68.6 U8.56(PD9) ; port SW_D2_CH1
SW1D3: R68.7 U8.55(PD8) ; port SW_D3_CH1
NetC15_2: C15.2 C37.1 U8.12(PH0-OSC_IN(PH0)) X1.3
NetC16_2: C16.2 U8.13(PH1-OSC_OUT(PH1)) X1.1
NetC37_2: C37.2 ; port MCU_25M
NetC38_2: C38.2 U8.73(VCAP_2)
NetC77_2: C77.2 U8.49(VCAP_1)
NetD1_1: D1.1(A) P3.1(VBUS)
NetD2_1: D2.1(A) USB1.1(VBUS)
NetLED1_1: LED1.1(A) U8.83(PD2)
NetLED1_2: LED1.2(K) R18.1
NetR11_2: U8.8(PC14-OSC32_IN(PC14)) ; port SDA, port CLOCK_SDA
NetR12_2: U8.7(PC13) ; port SCL, port CLOCK_SCL
NetR16_6: R69.6 U8.31(PA6) ; port MISO_CH1
NetR17_1: R17.1 SW1.2
NetR19_1: R53.5 U8.91(PB5) ; port ADC2_SD
NetR19_2: R53.6 U8.90(PB4(NJTRST)) ; port ADC2_SD_ext
NetR19_3: R53.8 U8.89(PB3(JTDO/TRACESWO)) ; port ADC2_CK
NetR37_9: U8.26(PA3) ; port CS_CALI
NetR53_1: R53.1 U8.47(PB10) ; port ADC1_CK
NetR53_2: R53.2 U8.51(PB12) ; port ADC1_WS
NetR53_3: R53.3 U8.53(PB14) ; port ADC1_SD_ext
NetR53_4: R53.4 U8.54(PB15) ; port ADC1_SD
NetR65_1: R68.2 U8.60(PD13) ; port SW_D3_CH2
NetR65_2: R68.3 U8.59(PD12) ; port SW_D2_CH2
NetR65_3: R68.4 U8.58(PD11) ; port SW_D1_CH2
NetR66_6: R69.3 U8.4(PE5) ; port MISO_CH2
NetR67_9: U8.95(PB8) ; port CS_CALI2

Not connected (* = marked no-connect by the designer): P3 4(SWO); R68 1 8; R69 2 7; U8 2(PE3) 3(PE4) 9(PC15-OSC32_OUT(PC15)) 14(NRST) 15(PC0) 16(PC1) 33(PC4) 34(PC5) 35(PB0) 36(PB1) 37(PB2-BOOT1(PB2)) 38(PE7) 39(PE8) 40(PE9) 41(PE10) 42(PE11) 43(PE12) 44(PE13) 45(PE14) 46(PE15) 48(PB11) 52(PB13) 61(PD14) 62(PD15) 63(PC6) 64(PC7) 65(PC8) 66(PC9) 67(PA8) 68(PA9) 69(PA10) 78(PC10) 79(PC11) 80(PC12) 82(PD1) 84(PD3) 85(PD4) 86(PD5) 87(PD6) 88(PD7) 98(PE1); USB1 4(ID) SH(Shell)

### Library data of the parts
C15 C16 C37 C38 C40 C41 C77 C166 C203 C204 = Cap: Capacitor
  C15 C16 C40 C41 C166 C203 C204: Published: 8-Jun-2000; LatestRevisionDate: 17-Jul-2002; LatestRevisionNote: Re-released for DXP Platform.; PackageReference: RAD-0.3; Publisher: Altium Limited; PackageDescription: Radial Cap, Thru-Hole; 2 Leads; 0.3 in Pin Spacing
D1 D2 = Diode 1N4148: High Conductance Fast Diode; Published: 8-Jun-2000; LatestRevisionDate: 17-Jul-2002; LatestRevisionNote: Re-released for DXP Platform.; DatasheetVersion: 1997; PackageReference: DO-35; Publisher: Altium Limited; PackageDescription: Diode, Axial; Body 3.8 x 1.9 mm (LxDia. max), Lead Dia. 0.53 mm (max); Code_JEDEC: DO-204-AH; ComponentLink1Description: Manufacturer Link; ComponentLink1URL: http://www.fairchildsemi.com/; ComponentLink2Description: Datasheet; ComponentLink2URL: http://www.fairchildsemi.com/ds/1N%2F1N4148.pdf
LED1 = LED0: Typical INFRARED GaAs LED; Published: 8-Jun-2000; LatestRevisionDate: 08-Jul-2005; LatestRevisionNote: Mech Layer 1 removed.; PackageReference: LED-0; Publisher: Altium Limited; PackageDescription: LED; 2 Leads
P3 = SWD_MicroUSB: Connector SMD USB Micro Type B middle mount; Manufacturer 1: Molex Inc; SCDType: undef; Package / Case: SMD; Supplier 1: Digi-Key; Supplier Part Number 1: WM17142CT-ND
R17 R18 = Res2: Resistor; Value: 0Ohm; Published: 8-Jun-2000; LatestRevisionDate: 17-Jul-2002; LatestRevisionNote: Re-released for DXP Platform.; PackageReference: AXIAL-0.4; Publisher: Altium Limited; PackageDescription: Axial Device, Thru-Hole; 2 Leads; 0.4 in Pin Spacing
R20 = Res2: Resistor; Published: 8-Jun-2000; LatestRevisionDate: 17-Jul-2002; LatestRevisionNote: Re-released for DXP Platform.; PackageReference: AXIAL-0.4; Publisher: Altium Limited; PackageDescription: Axial Device, Thru-Hole; 2 Leads; 0.4 in Pin Spacing
R53 R68 R69 = Res*4: Resistor; Published: 8-Jun-2000; LatestRevisionDate: 17-Jul-2002; LatestRevisionNote: Re-released for DXP Platform.; PackageReference: AXIAL-0.4; Publisher: Altium Limited; PackageDescription: Axial Device, Thru-Hole; 2 Leads; 0.4 in Pin Spacing
SW1 = SW-PB: Switch; Published: 24-Mar-1999; LatestRevisionDate: 17-Jul-2002; LatestRevisionNote: Re-released for DXP Platform.; PackageReference: SPST-2; Publisher: Altium Limited; PackageDescription: Switch; 2 Leads
U8 = STM32F407VET6: ARM Cortex-M4 32-bit MCU+FPU, 210 DMIPS, 512 kB Flash, 192 kB Internal RAM, 82 I/Os, 100-pin LQFP, -40 to 85 degC, Tray; Manufacturer: STMicroelectronics; D/A Converter: 2x12-bit; FLASH Size (Prog) (kB): 512; I/Os (High Current): 82; Internal RAM Size (kB): 192; Operating Frequency(F) (Processor speed) (MHz): 168; Supply Voltage(Vcc) max (V): 3.6; Supply Voltage(Vcc) min (V): 1.8; DatasheetVersion: Rev. 4; PackageVersion: Rev. 1, 06/2013; PackageReference: LQFP100; PackageDescription: 100-Pin Low Profile Quad Flat Package, 14 x 14 mm Body, 0.5 mm Pitch; Supplier 1: Digi-Key; Supplier Part Number 1: 497-12075-ND; Supplier 2: Farnell; Supplier Part Number 2: 2064367; Supplier 3: Newark; Supplier Part Number 3: 73T2332; Supplier 4: Mouser; Supplier Part Number 4: 511-STM32F407VET6; Core: ARM Cortex-M4; Packing: Tray; Mounting Technology: Surface Mount; PartNumber: STM32F407VET6; ComponentLink1Description: Manufacturer URL; ComponentLink1URL: http://www.st.com/web/en/home.html; ComponentLink2Description: Datasheet; ComponentLink2URL: http://www.st.com/st-web-ui/static/active/en/resource/technical/document/datasheet/DM00037051.pdf; ComponentLink3Description: Package Specification; ComponentLink3URL: http://www.st.com/st-web-ui/static/active/en/resource/technical/document/data_brief/DM00071938.pdf
USB1 = USB_Micro_TypeB: Connector SMD USB Micro Type B middle mount; Manufacturer 1: Molex Inc; SCDType: undef; Package / Case: SMD; Supplier 1: Digi-Key; Supplier Part Number 1: WM17142CT-ND
X1 = OSCILLATOR-3.2X2.5: Crystal Oscillator in 3.2x2.5 SMD

## Sheet connectorA.SchDoc
size A4
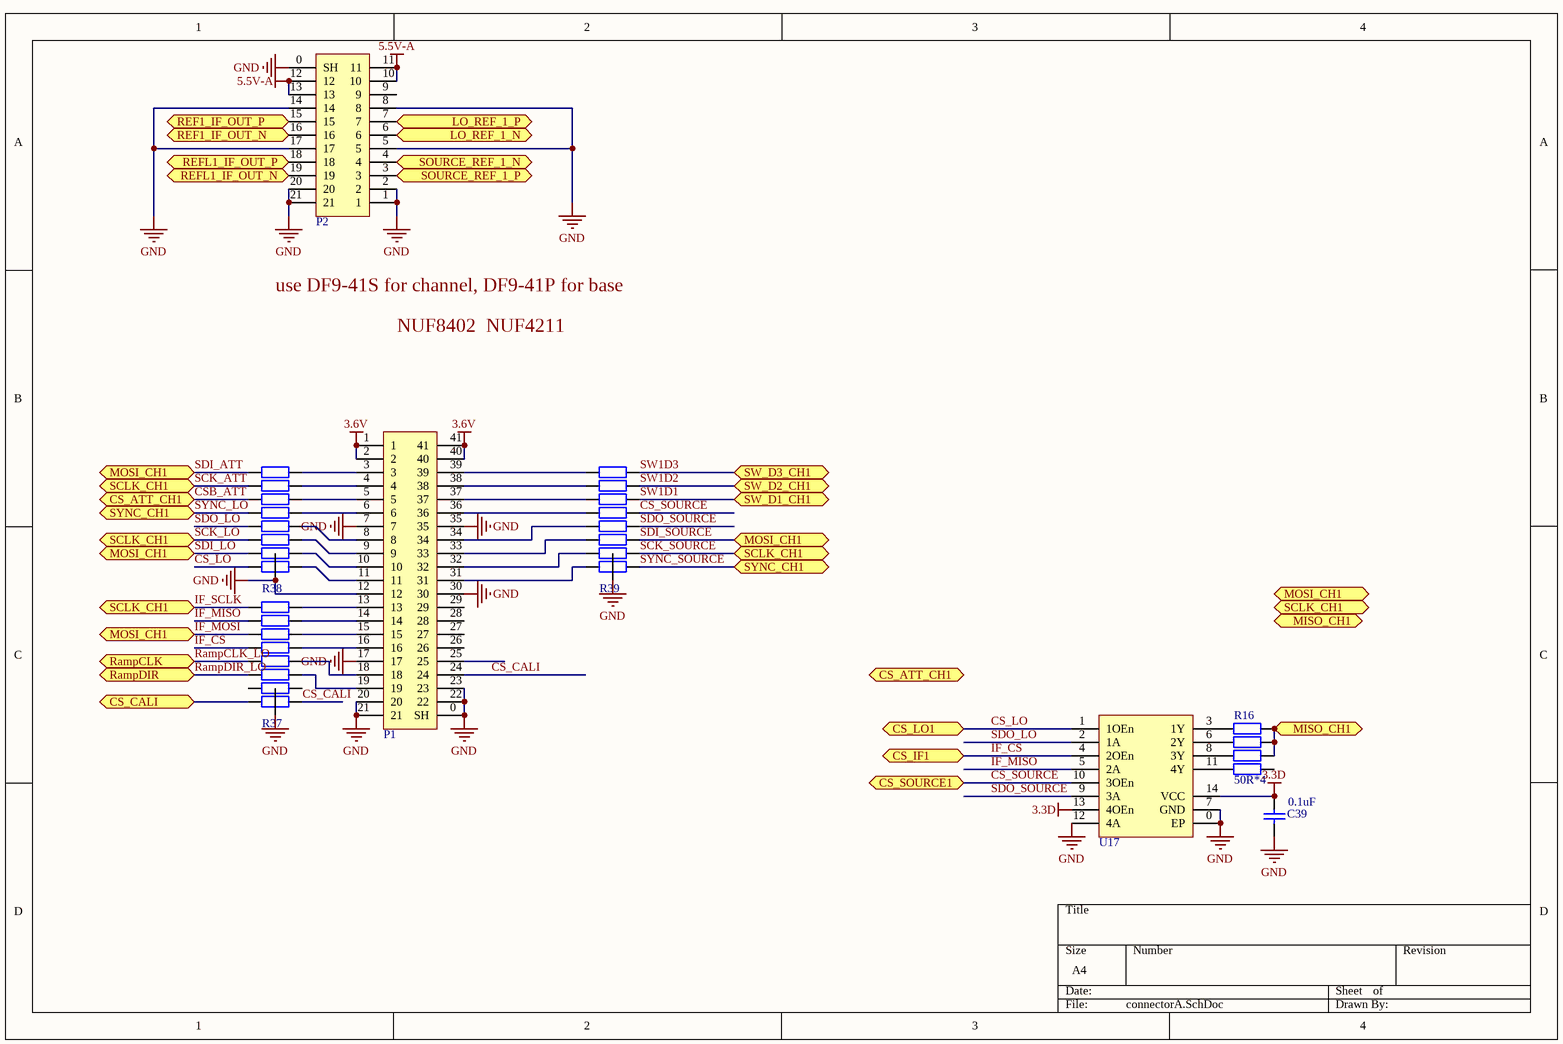
[diagram p7: connectorA.SchDoc]

### Parts
C39  0.1uF  [0402]
P1  DF9-41S  [VNA_CHANNEL]  (value not drawn)
P2  DF9-21  [DF9-21P]  (value not drawn)
R16  50R*4  [0402X4]
R37  NUF8xxx  [NUF8xxx]  (value not drawn)
R38  NUF8xxx  [NUF8xxx]  (value not drawn)
R39  NUF8xxx  [NUF8xxx]  (value not drawn)
U17  74-125-FUNC  [74LVC125ABQ]  (value not drawn)

### Ports
CS_ATT_CH1, CS_CALI, CS_IF1, CS_LO1, CS_SOURCE1, LO_REF_1_N, LO_REF_1_P, MISO_CH1, MOSI_CH1, RampCLK, RampDIR, REF1_IF_OUT_N, REF1_IF_OUT_P, REFL1_IF_OUT_N, REFL1_IF_OUT_P, SCLK_CH1, SOURCE_REF_1_N, SOURCE_REF_1_P, SW_D1_CH1, SW_D2_CH1, SW_D3_CH1, SYNC_CH1

### Nets
3.3D: C39.2 U17.13(4OEn) U17.14(VCC)
3.6V: P1.1 P1.2 P1.40 P1.41
5.5V-A: P2.10 P2.11 P2.12 P2.13
GND: C39.1 P1.0(SH) P1.7 P1.12 P1.17 P1.20 P1.21 P1.22 P1.23 P1.30 P1.35 P2.0(SH) P2.1 P2.2 P2.5 P2.8 P2.14 P2.17 P2.20 P2.21 R37.0 R38.0 R39.0 U17.0(EP) U17.7(GND) U17.12(4A)
CS_CALI: P1.24 R37.8
CS_LO: R38.9 U17.1(1OEn) ; port CS_LO1
CS_SOURCE: R39.4 U17.10(3OEn) ; port CS_SOURCE1
CSB_ATT: R38.14 ; port CS_ATT_CH1
IF_CS: R37.13 U17.4(2OEn) ; port CS_IF1
IF_MISO: R37.15 U17.5(2A)
IF_MOSI: R37.14 R38.10 R38.16 R39.6 ; port MOSI_CH1  [also labelled SDI_ATT, SDI_LO, SDI_SOURCE]
IF_SCLK: R37.16 R38.11 R38.15 R39.7 ; port SCLK_CH1  [also labelled SCK_ATT, SCK_LO, SCK_SOURCE]
LO_REF_1_N: P2.6 ; port LO_REF_1_N
LO_REF_1_P: P2.7 ; port LO_REF_1_P
R1_N: P2.16 ; port REF1_IF_OUT_N
R1_P: P2.15 ; port REF1_IF_OUT_P
RampCLK_LO: R37.12 ; port RampCLK
RampDIR_LO: R37.11 ; port RampDIR
RE1_N: P2.19 ; port REFL1_IF_OUT_N
RE1_P: P2.18 ; port REFL1_IF_OUT_P
SDO_LO: R38.12 U17.2(1A)
SDO_SOURCE: R39.5 U17.9(3A)
SOURCE_REF_1_N: P2.4 ; port SOURCE_REF_1_N
SOURCE_REF_1_P: P2.3 ; port SOURCE_REF_1_P
SW1D1: R39.3 ; port SW_D1_CH1
SW1D2: R39.2 ; port SW_D2_CH1
SW1D3: R39.1 ; port SW_D3_CH1
SYNC_LO: R38.13 R39.8 ; port SYNC_CH1  [also labelled SYNC_SOURCE]
NetP1_3: P1.3 R38.1
NetP1_4: P1.4 R38.2
NetP1_5: P1.5 R38.3
NetP1_6: P1.6 R38.4
NetP1_8: P1.8 R38.5
NetP1_9: P1.9 R38.6
NetP1_10: P1.10 R38.7
NetP1_11: P1.11 R38.8
NetP1_13: P1.13 R37.1
NetP1_14: P1.14 R37.2
NetP1_15: P1.15 R37.3
NetP1_16: P1.16 R37.4
NetP1_18: P1.18 R37.5
NetP1_19: P1.19 R37.6
NetP1_31: P1.31 R39.9
NetP1_32: P1.32 R39.10
NetP1_33: P1.33 R39.11
NetP1_34: P1.34 R39.12
NetP1_36: P1.36 R39.13
NetP1_37: P1.37 R39.14
NetP1_38: P1.38 R39.15
NetP1_39: P1.39 R39.16
NetR16_1: R16.1 U17.3(1Y)
NetR16_2: R16.2 U17.6(2Y)
NetR16_3: R16.3 U17.8(3Y)
NetR16_4: R16.4 U17.11(4Y)
NetR16_6: R16.6 R16.7 R16.8 ; port MISO_CH1
NetR37_9: R37.9 ; port CS_CALI

Not connected (* = marked no-connect by the designer): P1 25 26 27 28 29; P2 9; R16 5; R37 7 10

### Notes on the sheet
- use DF9-41S for channel, DF9-41P for base
- NUF8402  NUF4211

### Library data of the parts
C39 = Cap: Capacitor
R16 = Res*4: Resistor; Published: 8-Jun-2000; LatestRevisionDate: 17-Jul-2002; LatestRevisionNote: Re-released for DXP Platform.; PackageReference: AXIAL-0.4; Publisher: Altium Limited; PackageDescription: Axial Device, Thru-Hole; 2 Leads; 0.4 in Pin Spacing

## Sheet connectorB.SchDoc
size A4
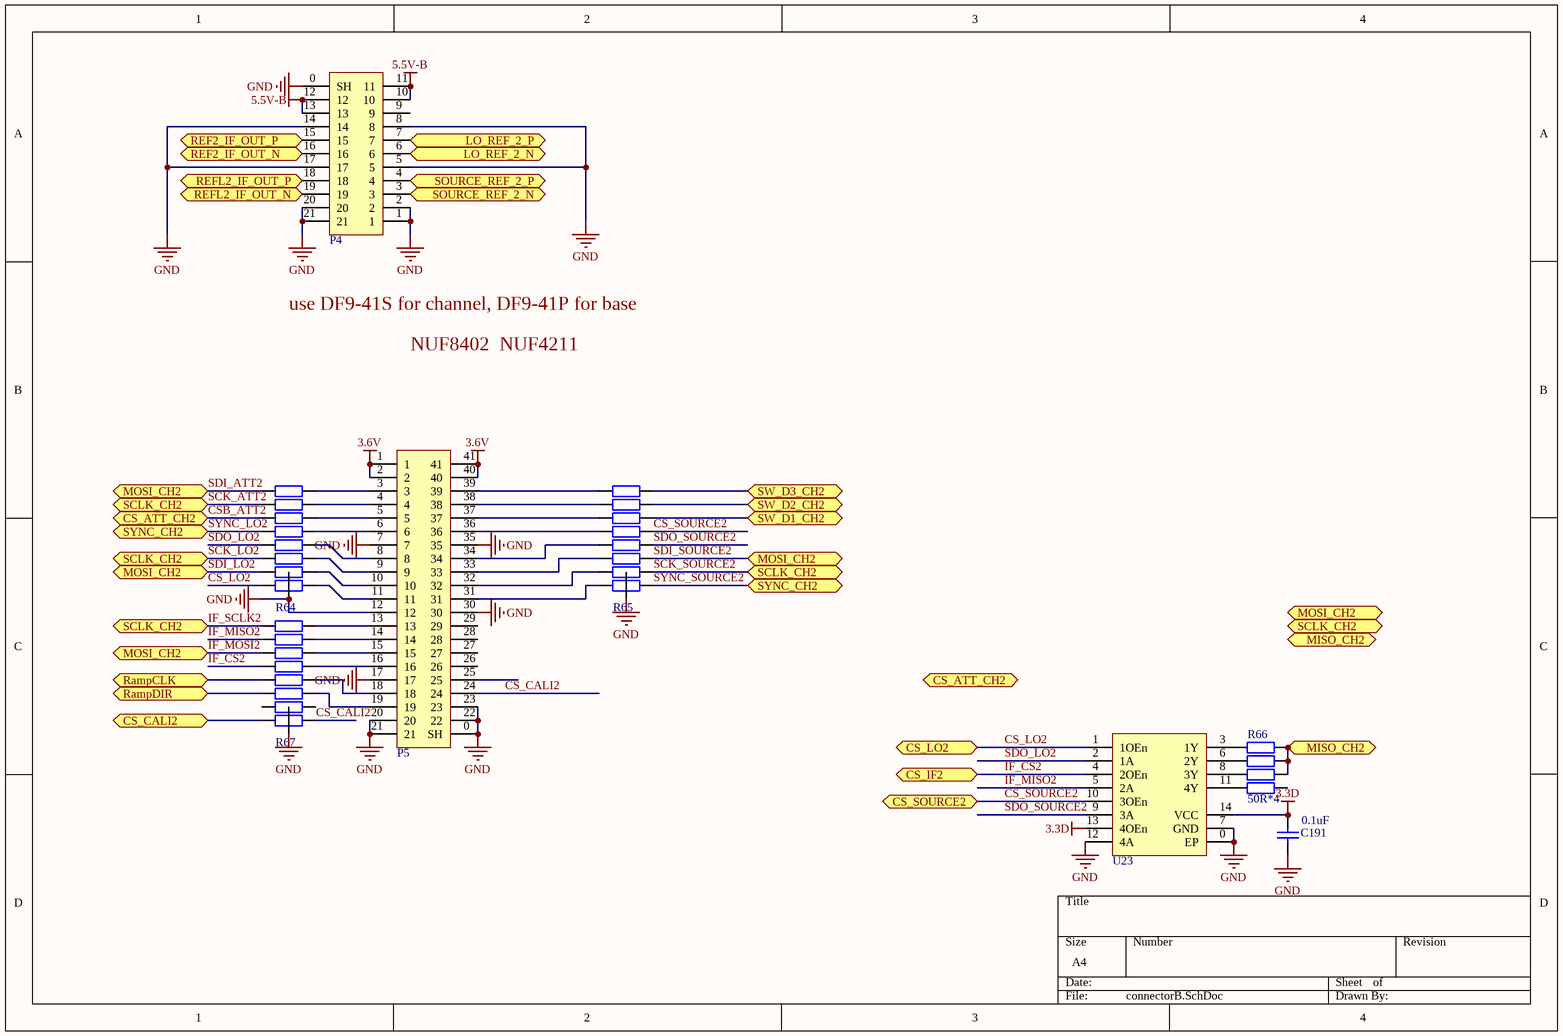
[diagram p8: connectorB.SchDoc]

### Parts
C191  0.1uF  [0402]
P4  DF9-21  [DF9-21P]  (value not drawn)
P5  DF9-41S  [VNA_CHANNEL]  (value not drawn)
R64  NUF8xxx  [NUF8xxx]  (value not drawn)
R65  NUF8xxx  [NUF8xxx]  (value not drawn)
R66  50R*4  [0402X4]
R67  NUF8xxx  [NUF8xxx]  (value not drawn)
U23  74-125-FUNC  [74LVC125ABQ]  (value not drawn)

### Ports
CS_ATT_CH2, CS_CALI2, CS_IF2, CS_LO2, CS_SOURCE2, LO_REF_2_N, LO_REF_2_P, MISO_CH2, MOSI_CH2, RampCLK, RampDIR, REF2_IF_OUT_N, REF2_IF_OUT_P, REFL2_IF_OUT_N, REFL2_IF_OUT_P, SCLK_CH2, SOURCE_REF_2_N, SOURCE_REF_2_P, SW_D1_CH2, SW_D2_CH2, SW_D3_CH2, SYNC_CH2

### Nets
3.3D: C191.2 U23.13(4OEn) U23.14(VCC)
3.6V: P5.1 P5.2 P5.40 P5.41
5.5V-B: P4.10 P4.11 P4.12 P4.13
GND: C191.1 P4.0(SH) P4.1 P4.2 P4.5 P4.8 P4.14 P4.17 P4.20 P4.21 P5.0(SH) P5.7 P5.12 P5.17 P5.20 P5.21 P5.22 P5.23 P5.30 P5.35 R64.0 R65.0 R67.0 U23.0(EP) U23.7(GND) U23.12(4A)
CS_CALI2: P5.24 R67.8
CS_LO2: R64.9 U23.1(1OEn) ; port CS_LO2
CS_SOURCE2: R65.4 U23.10(3OEn) ; port CS_SOURCE2
CSB_ATT2: R64.14 ; port CS_ATT_CH2
IF_CS2: R67.13 U23.4(2OEn) ; port CS_IF2
IF_MISO2: R67.15 U23.5(2A)
IF_MOSI2: R64.10 R64.16 R65.6 R67.14 ; port MOSI_CH2  [also labelled SDI_ATT2, SDI_LO2, SDI_SOURCE2]
IF_SCLK2: R64.11 R64.15 R65.7 R67.16 ; port SCLK_CH2  [also labelled SCK_ATT2, SCK_LO2, SCK_SOURCE2]
LO_REF_2_N: P4.6 ; port LO_REF_2_N
LO_REF_2_P: P4.7 ; port LO_REF_2_P
R2_N: P4.16 ; port REF2_IF_OUT_N
R2_P: P4.15 ; port REF2_IF_OUT_P
RampCLK_LO: R67.12 ; port RampCLK
RampDIR_LO: R67.11 ; port RampDIR
RE2_N: P4.19 ; port REFL2_IF_OUT_N
RE2_P: P4.18 ; port REFL2_IF_OUT_P
SDO_LO2: R64.12 U23.2(1A)
SDO_SOURCE2: R65.5 U23.9(3A)
SOURCE_REF_2_N: P4.3 ; port SOURCE_REF_2_N
SOURCE_REF_2_P: P4.4 ; port SOURCE_REF_2_P
SYNC_LO2: R64.13 R65.8 ; port SYNC_CH2  [also labelled SYNC_SOURCE2]
NetP5_3: P5.3 R64.1
NetP5_4: P5.4 R64.2
NetP5_5: P5.5 R64.3
NetP5_6: P5.6 R64.4
NetP5_8: P5.8 R64.5
NetP5_9: P5.9 R64.6
NetP5_10: P5.10 R64.7
NetP5_11: P5.11 R64.8
NetP5_13: P5.13 R67.1
NetP5_14: P5.14 R67.2
NetP5_15: P5.15 R67.3
NetP5_16: P5.16 R67.4
NetP5_18: P5.18 R67.5
NetP5_19: P5.19 R67.6
NetP5_31: P5.31 R65.9
NetP5_32: P5.32 R65.10
NetP5_33: P5.33 R65.11
NetP5_34: P5.34 R65.12
NetP5_36: P5.36 R65.13
NetP5_37: P5.37 R65.14
NetP5_38: P5.38 R65.15
NetP5_39: P5.39 R65.16
NetR65_1: R65.1 ; port SW_D3_CH2
NetR65_2: R65.2 ; port SW_D2_CH2
NetR65_3: R65.3 ; port SW_D1_CH2
NetR66_1: R66.1 U23.3(1Y)
NetR66_2: R66.2 U23.6(2Y)
NetR66_3: R66.3 U23.8(3Y)
NetR66_4: R66.4 U23.11(4Y)
NetR66_6: R66.6 R66.7 R66.8 ; port MISO_CH2
NetR67_9: R67.9 ; port CS_CALI2

Not connected (* = marked no-connect by the designer): P4 9; P5 25 26 27 28 29; R66 5; R67 7 10

### Notes on the sheet
- use DF9-41S for channel, DF9-41P for base
- NUF8402  NUF4211

### Library data of the parts
C191 = Cap: Capacitor
R66 = Res*4: Resistor; Published: 8-Jun-2000; LatestRevisionDate: 17-Jul-2002; LatestRevisionNote: Re-released for DXP Platform.; PackageReference: AXIAL-0.4; Publisher: Altium Limited; PackageDescription: Axial Device, Thru-Hole; 2 Leads; 0.4 in Pin Spacing

## Sheet power.SchDoc
size A4
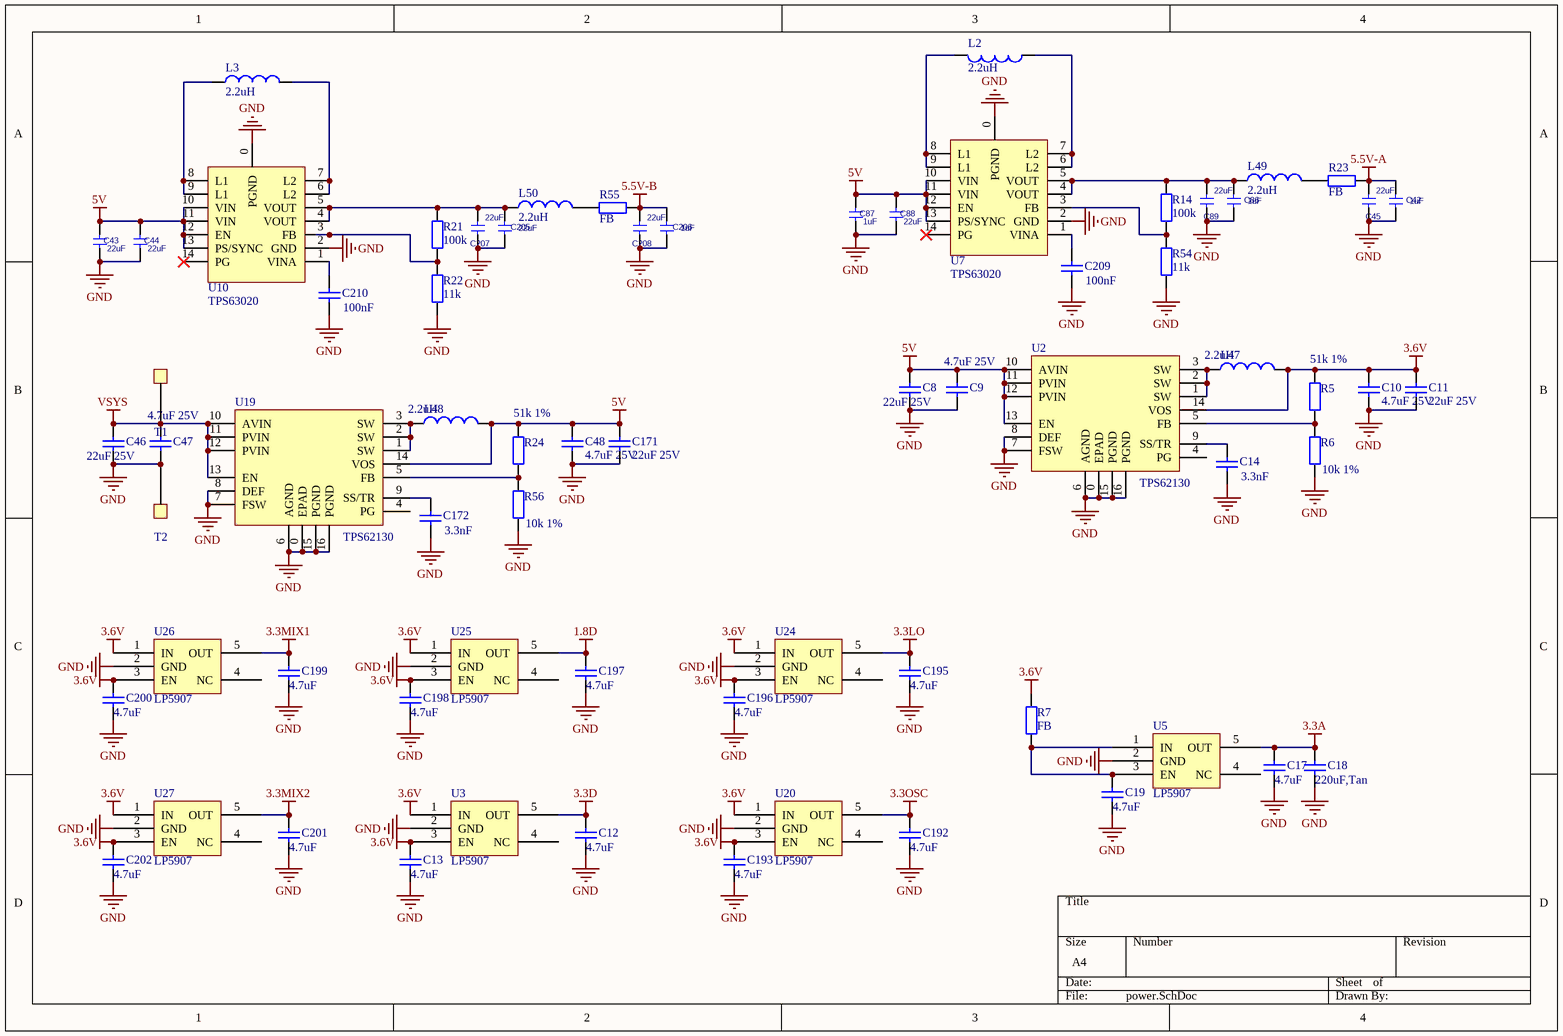
[diagram p9: power.SchDoc]

### Parts
C8  value 22uF 25V  [0805]  (hidden comment: Cap)
C9  value 4.7uF 25V  [0603]  (hidden comment: Cap)
C10  value 4.7uF 25V  [0603]  (hidden comment: Cap)
C11  value 22uF 25V  [0805]  (hidden comment: Cap)
C12  4.7uF  [0603L]
C13  4.7uF  [0603L]
C14  3.3nF  [0402]
C17  4.7uF  [0603L]
C18  220uF,Tan  [1210]
C19  4.7uF  [0603L]
C42  1uF  [0805]
C43  22uF  [0805]
C44  22uF  [0805]
C45  22uF  [0805]
C46  value 22uF 25V  [0805]  (hidden comment: Cap)
C47  value 4.7uF 25V  [0603]  (hidden comment: Cap)
C48  value 4.7uF 25V  [0603]  (hidden comment: Cap)
C86  1uF  [0805]
C87  1uF  [0805]
C88  22uF  [0805]
C89  22uF  [0805]
C171  value 22uF 25V  [0805]  (hidden comment: Cap)
C172  3.3nF  [0402]
C192  4.7uF  [0603L]
C193  4.7uF  [0603L]
C195  4.7uF  [0603L]
C196  4.7uF  [0603L]
C197  4.7uF  [0603L]
C198  4.7uF  [0603L]
C199  4.7uF  [0603L]
C200  4.7uF  [0603L]
C201  4.7uF  [0603L]
C202  4.7uF  [0603L]
C205  22uF  [0805]
C206  1uF  [0805]
C207  22uF  [0805]
C208  22uF  [0805]
C209  100nF  [0402]
C210  100nF  [0402]
L2  2.2uH  [L4015]
L3  2.2uH  [L4015]
L47  2.2uH  [L4015]
L48  2.2uH  [L4015]
L49  2.2uH  [L4015]
L50  2.2uH  [L4015]
R5  51k 1%  [0402]
R6  10k 1%  [0402]
R7  FB  [0603L]
R14  100k  [0402]
R21  100k  [0402]
R22  11k  [0402]
R23  FB  [0603L]
R24  51k 1%  [0402]
R54  11k  [0402]
R55  FB  [0603L]
R56  10k 1%  [0402]
T1  TestPad  [TestPad]  (value not drawn)
T2  TestPad  [TestPad]  (value not drawn)
U2  TPS62130  [TPS62130]
U3  LP5907  [SOT23-5]
U5  LP5907  [SOT23-5]
U7  TPS63020  [TPS63020]
U10  TPS63020  [TPS63020]
U19  TPS62130  [TPS62130]
U20  LP5907  [SOT23-5]
U24  LP5907  [SOT23-5]
U25  LP5907  [SOT23-5]
U26  LP5907  [SOT23-5]
U27  LP5907  [SOT23-5]

### Nets
1.8D: C197.2 U25.5(OUT)
3.3A: C17.2 C18.2 U5.5(OUT)
3.3D: C12.2 U3.5(OUT)
3.3LO: C195.2 U24.5(OUT)
3.3MIX1: C199.2 U26.5(OUT)
3.3MIX2: C201.2 U27.5(OUT)
3.3OSC: C192.2 U20.5(OUT)
3.6V: C10.2 C11.2 C13.2 C193.2 C196.2 C198.2 C200.2 C202.2 L47.2 R5.1 R7.2 U2.14(VOS) U3.1(IN) U3.3(EN) U20.1(IN) U20.3(EN) U24.1(IN) U24.3(EN) U25.1(IN) U25.3(EN) U26.1(IN) U26.3(EN) U27.1(IN) U27.3(EN)
5.5V-A: C42.1 C45.1 R23.1
5.5V-B: C206.1 C208.1 R55.1
5V: C8.1 C9.1 C43.1 C44.1 C48.2 C87.1 C88.1 C171.2 L48.2 R24.1 U2.10(AVIN) U2.11(PVIN) U2.12(PVIN) U2.13(EN) U7.10(VIN) U7.11(VIN) U7.12(EN) U7.13(PS/SYNC) U10.10(VIN) U10.11(VIN) U10.12(EN) U10.13(PS/SYNC) U19.14(VOS)
GND: C8.2 C9.2 C10.1 C11.1 C12.1 C13.1 C14.2 C17.1 C18.1 C19.1 C42.2 C43.2 C44.2 C45.2 C46.2 C47.2 C48.1 C86.2 C87.2 C88.2 C89.2 C171.1 C172.2 C192.1 C193.1 C195.1 C196.1 C197.1 C198.1 C199.1 C200.1 C201.1 C202.1 C205.2 C206.2 C207.2 C208.2 C209.2 C210.2 R6.2 R22.2 R54.2 R56.2 T2.1 U2.0(EPAD) U2.6(AGND) U2.7(FSW) U2.8(DEF) U2.15(PGND) U2.16(PGND) U3.2(GND) U5.2(GND) U7.0(PGND) U7.2(GND) U10.0(PGND) U10.2(GND) U19.0(EPAD) U19.6(AGND) U19.7(FSW) U19.8(DEF) U19.15(PGND) U19.16(PGND) U20.2(GND) U24.2(GND) U25.2(GND) U26.2(GND) U27.2(GND)
VSYS: C46.1 C47.1 T1.1 U19.10(AVIN) U19.11(PVIN) U19.12(PVIN) U19.13(EN)
NetC14_1: C14.1 U2.9(SS/TR)
NetC19_2: C19.2 R7.1 U5.1(IN) U5.3(EN)
NetC86_1: C86.1 C89.1 L49.1 R14.1 U7.4(VOUT) U7.5(VOUT)
NetC172_1: C172.1 U19.9(SS/TR)
NetC205_1: C205.1 C207.1 L50.1 R21.1 U10.4(VOUT) U10.5(VOUT)
NetC209_1: C209.1 U7.1(VINA)
NetC210_1: C210.1 U10.1(VINA)
NetL2_1: L2.1 U7.6(L2) U7.7(L2)
NetL2_2: L2.2 U7.8(L1) U7.9(L1)
NetL3_1: L3.1 U10.8(L1) U10.9(L1)
NetL3_2: L3.2 U10.6(L2) U10.7(L2)
NetL47_1: L47.1 U2.1(SW) U2.2(SW) U2.3(SW)
NetL48_1: L48.1 U19.1(SW) U19.2(SW) U19.3(SW)
NetL49_2: L49.2 R23.2
NetL50_2: L50.2 R55.2
NetR5_2: R5.2 R6.1 U2.5(FB)
NetR14_2: R14.2 R54.1 U7.3(FB)
NetR21_2: R21.2 R22.1 U10.3(FB)
NetR24_2: R24.2 R56.1 U19.5(FB)

Not connected (* = marked no-connect by the designer): U2 4(PG); U3 4(NC); U5 4(NC); U7 14(PG)*; U10 14(PG)*; U19 4(PG); U20 4(NC); U24 4(NC); U25 4(NC); U26 4(NC); U27 4(NC)

### Library data of the parts
C8-C14 C17-C19 C46-C48 C171 C172 C192 C193 C195-C202 C209 C210 = Cap: Capacitor; Published: 8-Jun-2000; LatestRevisionDate: 17-Jul-2002; LatestRevisionNote: Re-released for DXP Platform.; PackageReference: RAD-0.3; Publisher: Altium Limited; PackageDescription: Radial Cap, Thru-Hole; 2 Leads; 0.3 in Pin Spacing
C42-C45 C86-C89 C205-C208 = C: PCB DECAL: C0805; Source_Path: C:\USERS\EULER-SJ\DESKTOP\CHEN-PI2\LIBRARY1.OLB; Value: 10uF/16V; PSpiceTemplate: C^@REFDES %1 %2 ?TOLERANCE|C^@REFDES| @VALUE ?IC/IC=@IC/ ?TOLERANCE|\n.model C^@REFDES CAP C=1 DEV=@TOLERANCE%|
L2 L3 L47-L50 = Inductor: Code_IEC: 1005; Published: 8-Jun-2000; LatestRevisionDate: 29-May-2009; LatestRevisionNote: IPC-7351 Footprint Added.; PackageReference: 0402-A; Publisher: Altium Limited; PackageDescription: Chip Inductor; Code_JEITA: 0402
R5 R6 R14 R21 R22 R24 R54 R56 = Res2: Resistor; Published: 8-Jun-2000; LatestRevisionDate: 17-Jul-2002; LatestRevisionNote: Re-released for DXP Platform.; PackageReference: AXIAL-0.4; Publisher: Altium Limited; PackageDescription: Axial Device, Thru-Hole; 2 Leads; 0.4 in Pin Spacing
R7 R23 R55 = Res2: Resistor; Value: 0Ohm; Published: 8-Jun-2000; LatestRevisionDate: 17-Jul-2002; LatestRevisionNote: Re-released for DXP Platform.; PackageReference: AXIAL-0.4; Publisher: Altium Limited; PackageDescription: Axial Device, Thru-Hole; 2 Leads; 0.4 in Pin Spacing

## Nets that join several sheets
1.8D: AudioADCA (C182.2 U22.22), AudioADCB (C173.2 U21.22), power (C197.2 U25.5)
3.3A: AudioADCA (8 pins), AudioADCB (8 pins), power (C17.2 C18.2 U5.5)
3.3D: AudioADCA (7 pins), AudioADCB (9 pins), MCU (15 pins), connectorA (C39.2 U17.13 U17.14), connectorB (C191.2 U23.13 U23.14), power (C12.2 U3.5)
3.3LO: clock (14 pins), power (C195.2 U24.5)
3.3MIX1: downmixersA (10 pins), power (C199.2 U26.5)
3.3MIX2: downmixersB (10 pins), power (C201.2 U27.5)
3.3OSC: clock (29 pins), power (C192.2 U20.5)
3.6V: connectorA (P1.1 P1.2 P1.40 P1.41), connectorB (P5.1 P5.2 P5.40 P5.41), power (24 pins)
5.5V-A: connectorA (P2.10 P2.11 P2.12 P2.13), power (C42.1 C45.1 R23.1)
5.5V-B: connectorB (P4.10 P4.11 P4.12 P4.13), power (C206.1 C208.1 R55.1)
5V: MCU (D1.2 D2.2), power (23 pins)
GND: downmixersA (12 pins), downmixersB (12 pins), AudioADCA (25 pins), AudioADCB (23 pins), clock (34 pins), MCU (20 pins), connectorA (26 pins), connectorB (26 pins), power (67 pins)
CS_LO: MCU (U8.24), connectorA (R38.9 U17.1)
CS_LO2: MCU (U8.92), connectorB (R64.9 U23.1)
CS_SOURCE: MCU (U8.29), connectorA (R39.4 U17.10)
CS_SOURCE2: MCU (U8.96), connectorB (R65.4 U23.10)
CSB_ATT: MCU (U8.25), connectorA (R38.14)
CSB_ATT2: MCU (U8.93), connectorB (R64.14)
IF_CS: MCU (U8.23), connectorA (R37.13 U17.4)
IF_CS2: MCU (U8.97), connectorB (R67.13 U23.4)
IF_MOSI: MCU (R69.5 U8.32), connectorA (R37.14 R38.10 R38.16 R39.6)
IF_MOSI2: MCU (R69.4 U8.5), connectorB (R64.10 R64.16 R65.6 R67.14)
IF_SCLK: MCU (R69.8 U8.30), connectorA (R37.16 R38.11 R38.15 R39.7)
IF_SCLK2: MCU (R69.1 U8.1), connectorB (R64.11 R64.15 R65.7 R67.16)
LO_REF_1_N: clock (U12.6), connectorA (P2.6)
LO_REF_1_P: clock (U12.7), connectorA (P2.7)
LO_REF_2_N: clock (U12.19), connectorB (P4.6)
LO_REF_2_P: clock (U12.18), connectorB (P4.7)
NetC37_2: clock (U13.9), MCU (C37.2)
NetC57_2: downmixersA (C57.2 L1.2), clock (R51.1)
NetC79_2: downmixersA (C79.2 L14.2), clock (R50.1)
NetC115_2: downmixersB (C115.2 L25.2), clock (R48.2)
NetC140_2: downmixersB (C140.2 L36.2), clock (R49.2)
NetR8_2: AudioADCB (R9.2), clock (R8.2)
NetR11_2: AudioADCA (R36.1 U11.31 U22.18), AudioADCB (R30.1 U6.31 U21.18), clock (R11.2 U13.5), MCU (U8.8)
NetR12_2: AudioADCA (R35.1 U11.32 U22.17), AudioADCB (R29.1 U6.32 U21.17), clock (R12.2 U13.4), MCU (U8.7)
NetR16_6: MCU (R69.6 U8.31), connectorA (R16.6 R16.7 R16.8)
NetR19_1: AudioADCB (R19.1 R60.8), MCU (R53.5 U8.91)
NetR19_2: AudioADCB (R19.2), MCU (R53.6 U8.90)
NetR19_3: AudioADCB (R19.3 R60.6), MCU (R53.8 U8.89)
NetR37_9: MCU (U8.26), connectorA (R37.9)
NetR40_2: AudioADCA (R40.2 R63.5), clock (R47.2 R76.1)
NetR53_1: AudioADCA (R58.3 R63.6), MCU (R53.1 U8.47)
NetR53_2: AudioADCA (R58.4 R63.7), MCU (R53.2 U8.51)
NetR53_3: AudioADCA (R58.2), MCU (R53.3 U8.53)
NetR53_4: AudioADCA (R58.1 R63.8), MCU (R53.4 U8.54)
NetR60_5: AudioADCA (U22.19), AudioADCB (R60.5)
NetR65_1: MCU (R68.2 U8.60), connectorB (R65.1)
NetR65_2: MCU (R68.3 U8.59), connectorB (R65.2)
NetR65_3: MCU (R68.4 U8.58), connectorB (R65.3)
NetR66_6: MCU (R69.3 U8.4), connectorB (R66.6 R66.7 R66.8)
NetR67_9: MCU (U8.95), connectorB (R67.9)
PA15: AudioADCB (R19.4 R60.7), MCU (R53.7 U8.77)
R1_N: downmixersA (C76.1), connectorA (P2.16)
R1_P: downmixersA (C61.1), connectorA (P2.15)
R2_N: downmixersB (C135.1), connectorB (P4.16)
R2_P: downmixersB (C121.1), connectorB (P4.15)
RampCLK_LO: MCU (U8.17), connectorA (R37.12), connectorB (R67.12)
RampDIR_LO: MCU (U8.18), connectorA (R37.11), connectorB (R67.11)
RE1_N: downmixersA (C97.1), connectorA (P2.19)
RE1_P: downmixersA (C85.1), connectorA (P2.18)
RE2_N: downmixersB (C158.1), connectorB (P4.19)
RE2_P: downmixersB (C146.1), connectorB (P4.18)
REF1_N: downmixersA (C70.1 C75.1 L11.1), AudioADCA (C112.1 C188.2)
REF1_P: downmixersA (C69.2 C70.2 L7.2), AudioADCA (C111.1 C189.2)
REF2_N: downmixersB (C129.1 C133.1 L33.1), AudioADCB (C31.1 C179.2)
REF2_P: downmixersB (C128.2 C129.2 L27.2), AudioADCB (C30.1 C180.2)
REFLECT1_N: downmixersA (C93.1 C95.1 L22.1), AudioADCA (C109.2 C185.2)
REFLECT1_P: downmixersA (C92.2 C93.2 L16.2), AudioADCA (C108.2 C187.2)
REFLECT2_N: downmixersB (C154.1 C156.1 L44.1), AudioADCB (C28.2 C176.2)
REFLECT2_P: downmixersB (C153.2 C154.2 L38.2), AudioADCB (C27.2 C178.2)
SOURCE_REF_1_N: clock (U12.3), connectorA (P2.4)
SOURCE_REF_1_P: clock (U12.4), connectorA (P2.3)
SOURCE_REF_2_N: clock (U12.22), connectorB (P4.3)
SOURCE_REF_2_P: clock (U12.21), connectorB (P4.4)
SW1D1: MCU (R68.5 U8.57), connectorA (R39.3)
SW1D2: MCU (R68.6 U8.56), connectorA (R39.2)
SW1D3: MCU (R68.7 U8.55), connectorA (R39.1)